# EAGLE design Radio (EAGLE 6.5.0)

## Sheet 1 of 12: Voltage Regulator
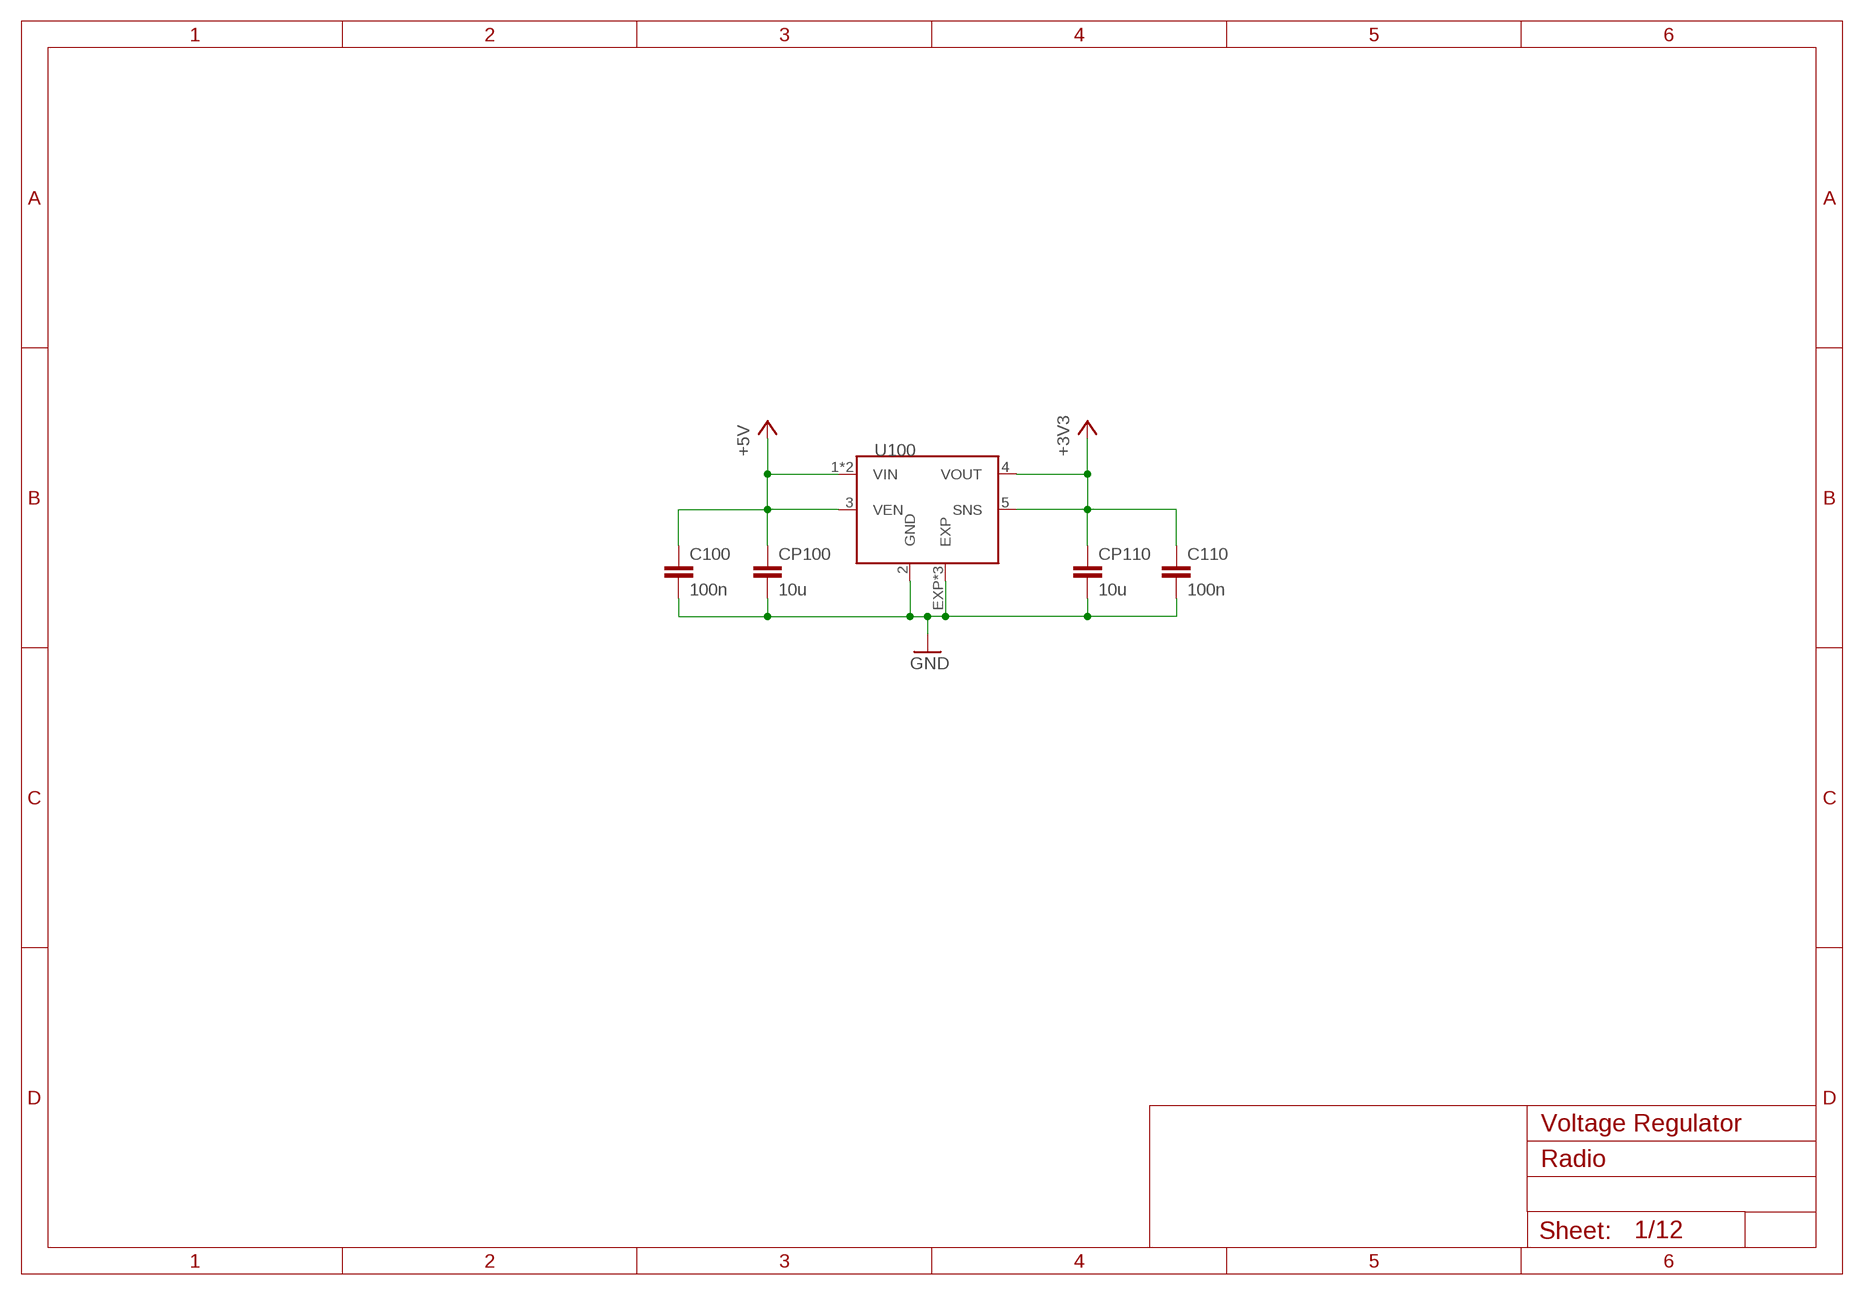
[diagram p0: schematic, sheet 1]

### Parts
C100  100n  C-EUC1206K  [C1206K]
C110  100n  C-EUC1206K  [C1206K]
CP100  10u  C-EUC1206K  [C1206K]
CP110  10u  C-EUC1206K  [C1206K]
U100  LP38693  [LP38693_WSON]

### Nets
+3V3: C110.1 CP110.1 U100.4(VOUT) U100.5(SNS) ; also sheet 2,3,4,5,7,9,11,12
+5V: C100.1 CP100.1 U100.1(VIN) U100.3(VEN) U100.6(VIN) ; also sheet 3,4,6,10,12
GND: C100.2 C110.2 CP100.2 CP110.2 U100.2(GND) U100.EXP U100.EXP1(EXP) U100.EXP2(EXP) ; also sheet 2,4,5,6,7,8,9,10,11,12

## Sheet 2 of 12: MSP430G2553
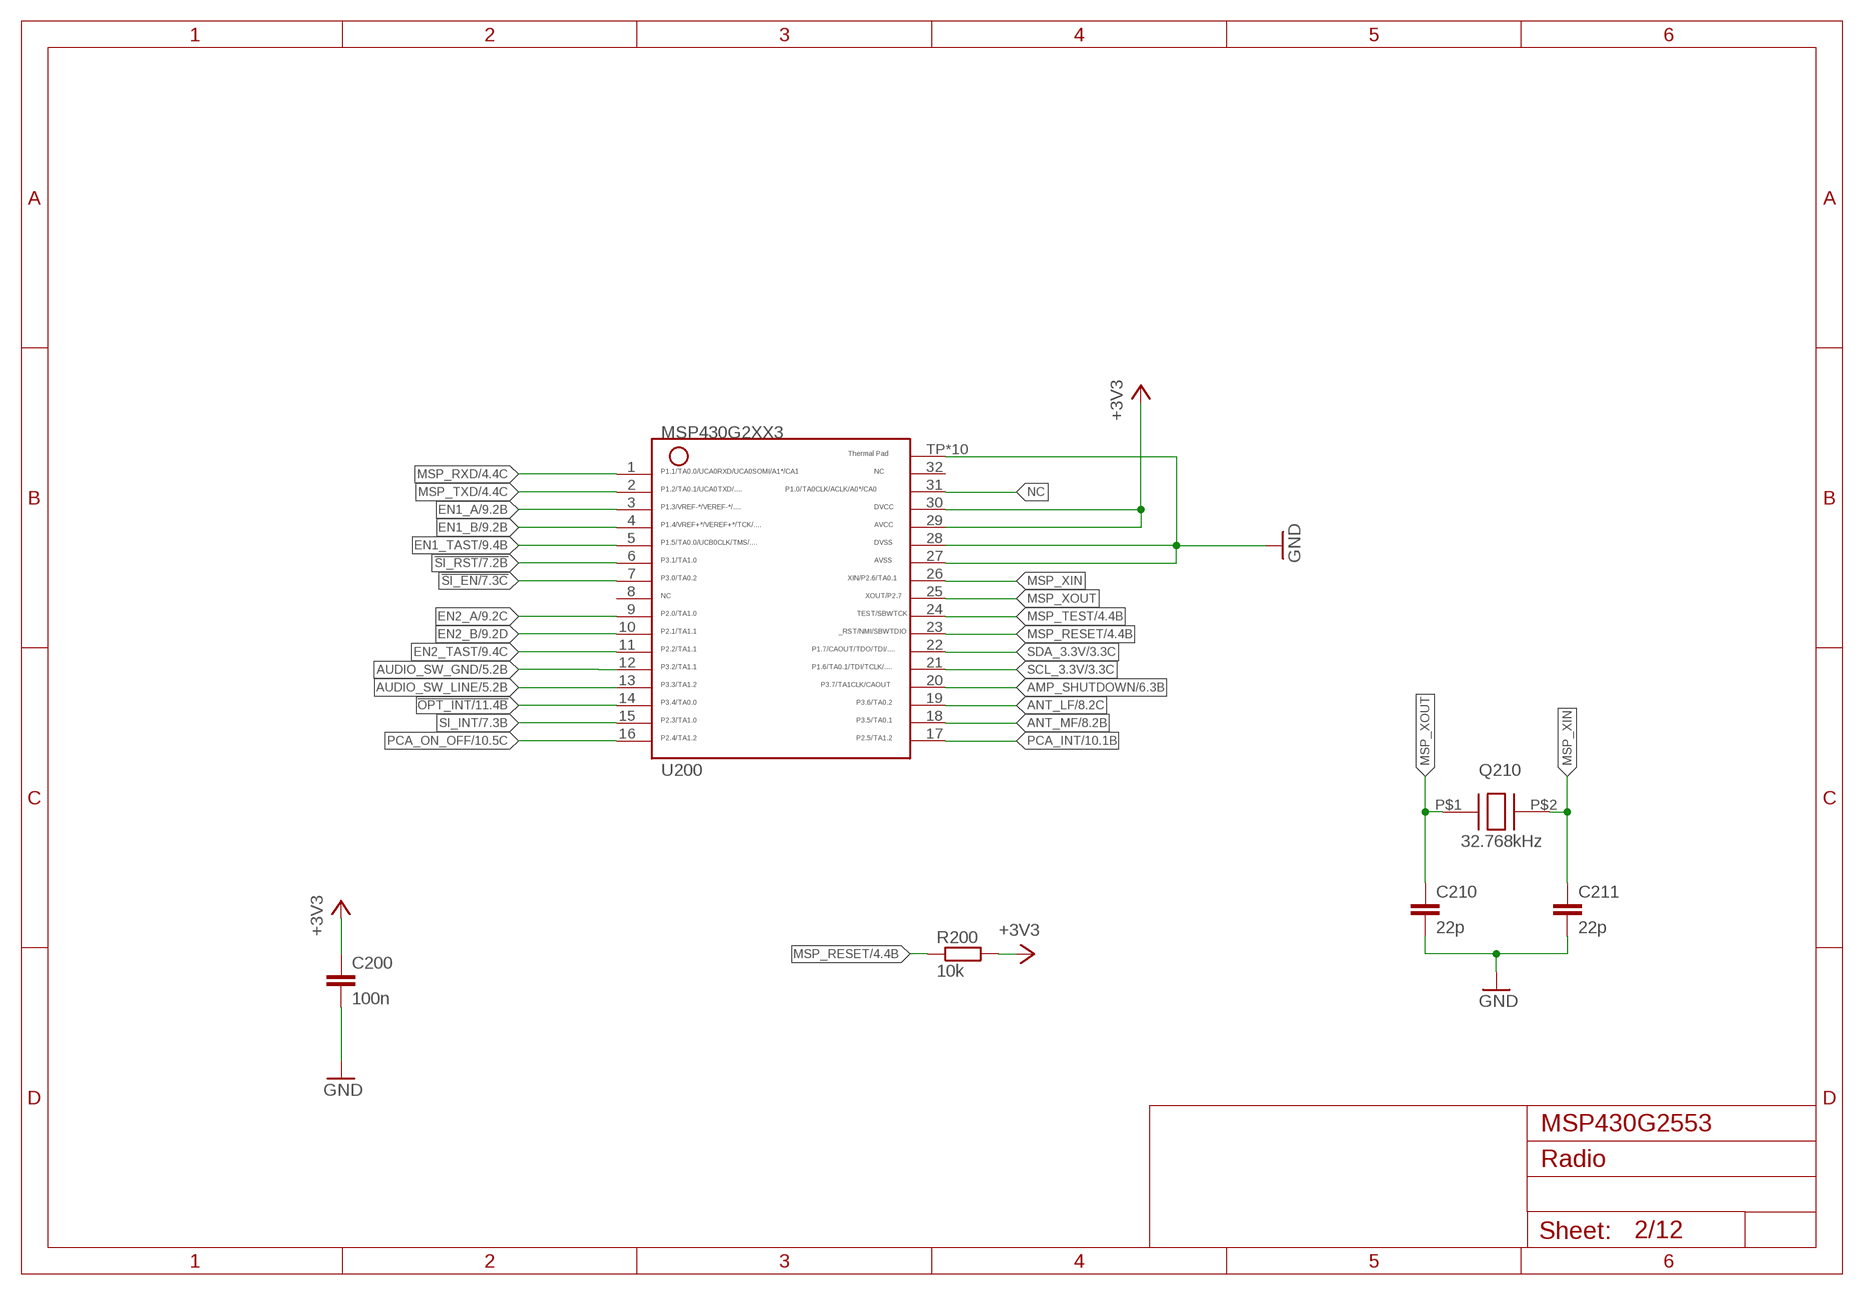
[diagram p1: schematic, sheet 2]

### Parts
C200  100n  C-EUC1206K  [C1206K]
C210  22p  C-EUC1206K  [C1206K]
C211  22p  C-EUC1206K  [C1206K]
Q210  32.768kHz  QUARZ32.768KHZSMD  [CM7V-T1A]
R200  10k  R-EU_R1206  [R1206]
U200  MSP430G2553  G2XX3---RHB32  [RHB32]

### Nets
!OPT_INT: U200.14 ; also sheet 11
!SI_EN: U200.7 ; also sheet 7
!SI_RST: U200.6 ; also sheet 7
+3V3: C200.1 R200.2 U200.29 U200.30 ; also sheet 1,3,4,5,7,9,11,12
AMP_SHUTDOWN: U200.20 ; also sheet 6
ANT_LF: U200.19 ; also sheet 8
ANT_MF: U200.18 ; also sheet 8
AUDIO_SW_GND: U200.12 ; also sheet 5
AUDIO_SW_LINE: U200.13 ; also sheet 5
EN1_A: U200.3 ; also sheet 9
EN1_B: U200.4 ; also sheet 9
EN1_TAST: U200.5 ; also sheet 9
EN2_A: U200.9 ; also sheet 9
EN2_B: U200.10 ; also sheet 9
EN2_TAST: U200.11 ; also sheet 9
GND: C200.2 C210.2 C211.2 U200.27 U200.28 U200.TP U200.TP1(TP) U200.TP2(TP) U200.TP3(TP) U200.TP4(TP) U200.TP5(TP) U200.TP6(TP) U200.TP7(TP) U200.TP8(TP) U200.TP9(TP) ; also sheet 1,4,5,6,7,8,9,10,11,12
MSP_RESET: R200.1 U200.23 ; also sheet 4,12
MSP_RXD: U200.1 ; also sheet 4,12
MSP_TEST: U200.24 ; also sheet 4,12
MSP_TXD: U200.2 ; also sheet 4,12
MSP_XIN: C211.1 Q210.P$2 U200.26
MSP_XOUT: C210.1 Q210.P$1 U200.25
NC: U200.31
PCA_INT: U200.17 ; also sheet 10
PCA_ON_OFF: U200.16 ; also sheet 10
SCL_3.3V: U200.21 ; also sheet 3,4,7,11,12
SDA_3.3V: U200.22 ; also sheet 3,4,7,11,12
SI_INT: U200.15 ; also sheet 7
Unconnected: U200.8 U200.32

## Sheet 3 of 12: I2C Levelshifter
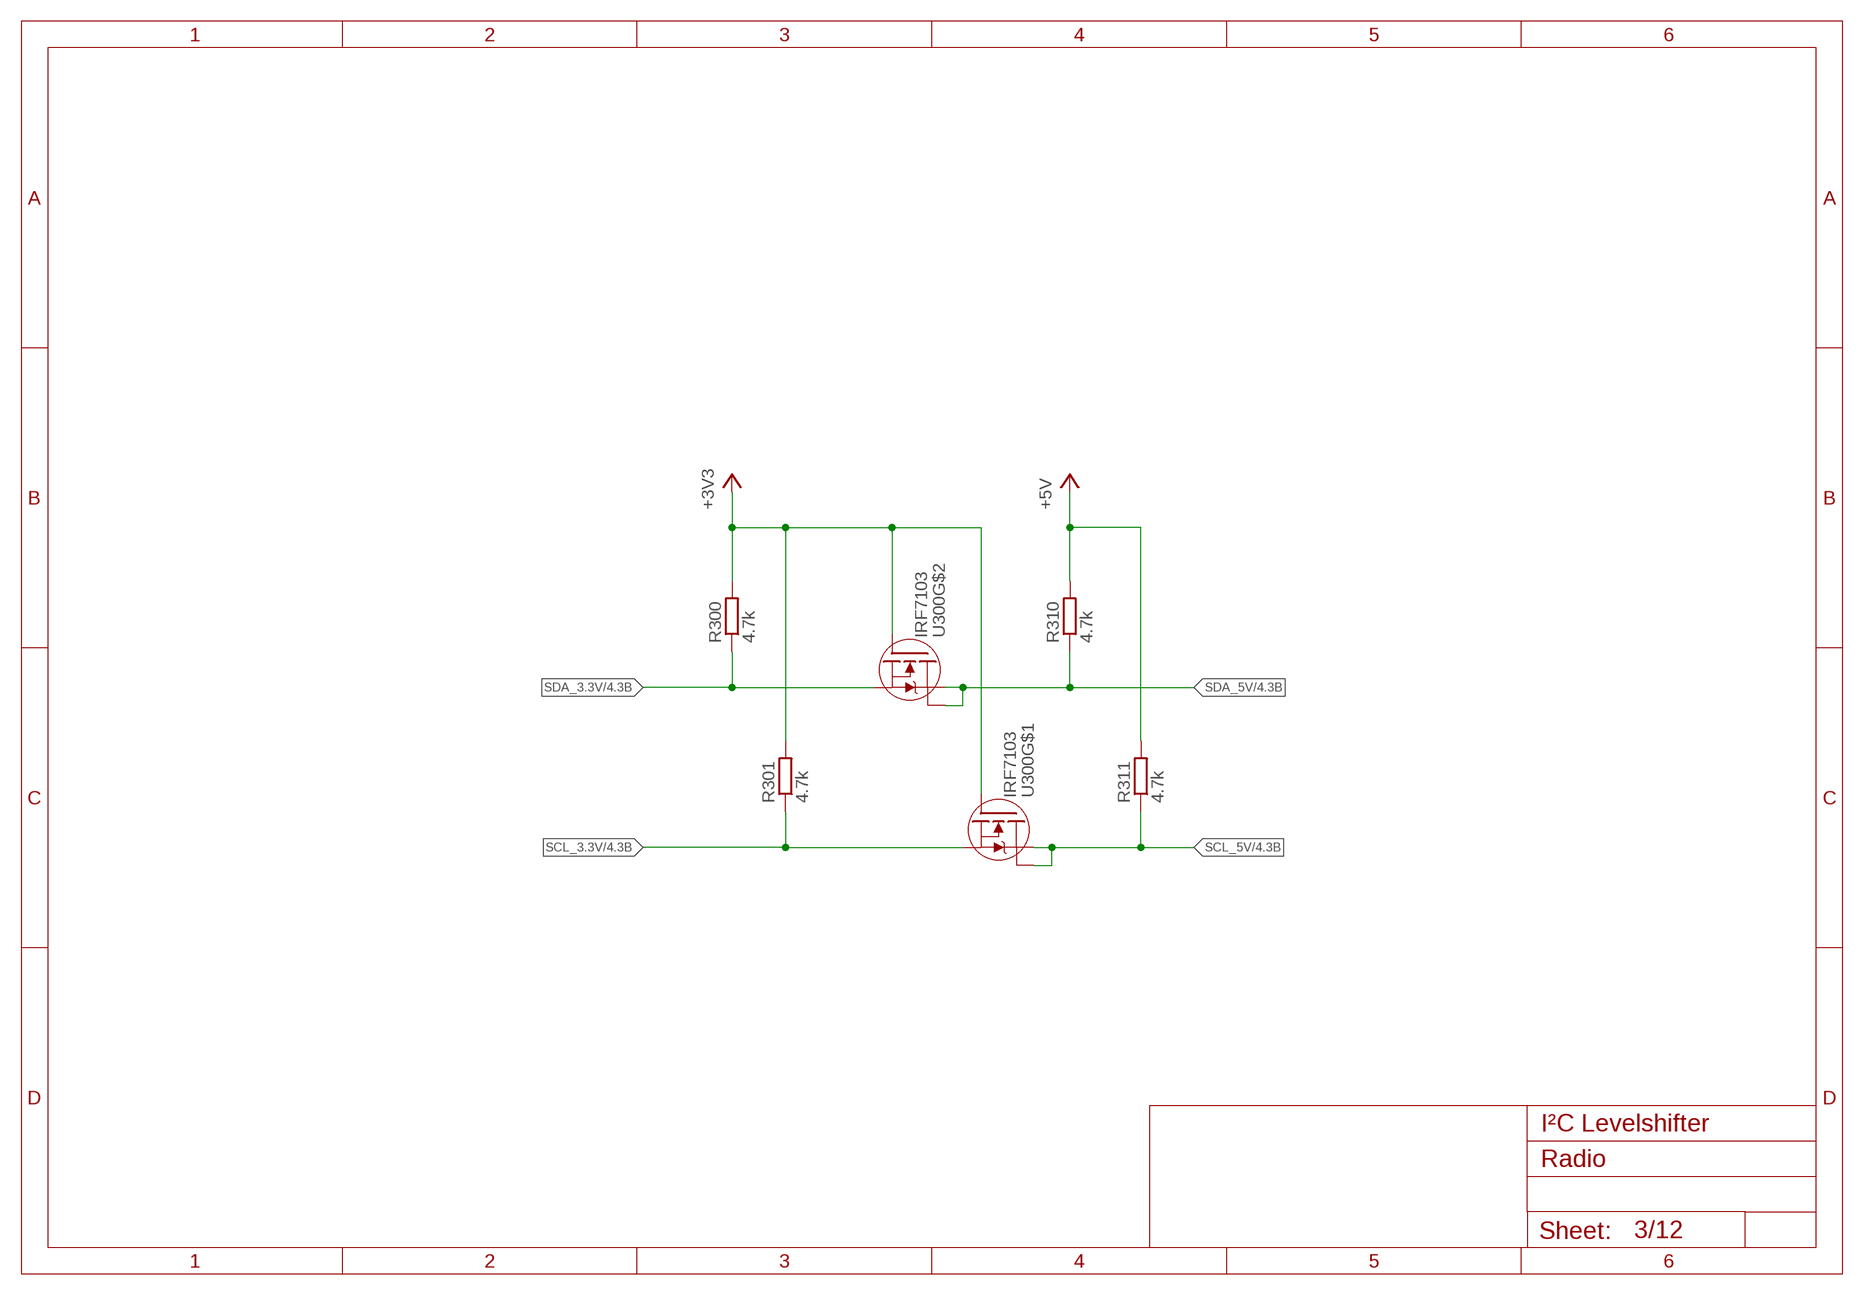
[diagram p2: schematic, sheet 3]

### Parts
R300  4.7k  R-EU_R1206  [R1206]
R301  4.7k  R-EU_R1206  [R1206]
R310  4.7k  R-EU_R1206  [R1206]
R311  4.7k  R-EU_R1206  [R1206]
U300  IRF7103  [SO8-2]

### Nets
+3V3: R300.2 R301.2 U300.2(G) U300.4(G) ; also sheet 1,2,4,5,7,9,11,12
+5V: R310.2 R311.2 ; also sheet 1,4,6,10,12
SCL_3.3V: R301.1 U300.1(S) ; also sheet 2,4,7,11,12
SCL_5V: R311.1 U300.7(D) U300.8(D) ; also sheet 4,6,10,12
SDA_3.3V: R300.1 U300.3(S) ; also sheet 2,4,7,11,12
SDA_5V: R310.1 U300.5(D) U300.6(D) ; also sheet 4,6,10,12

## Sheet 4 of 12: Connector
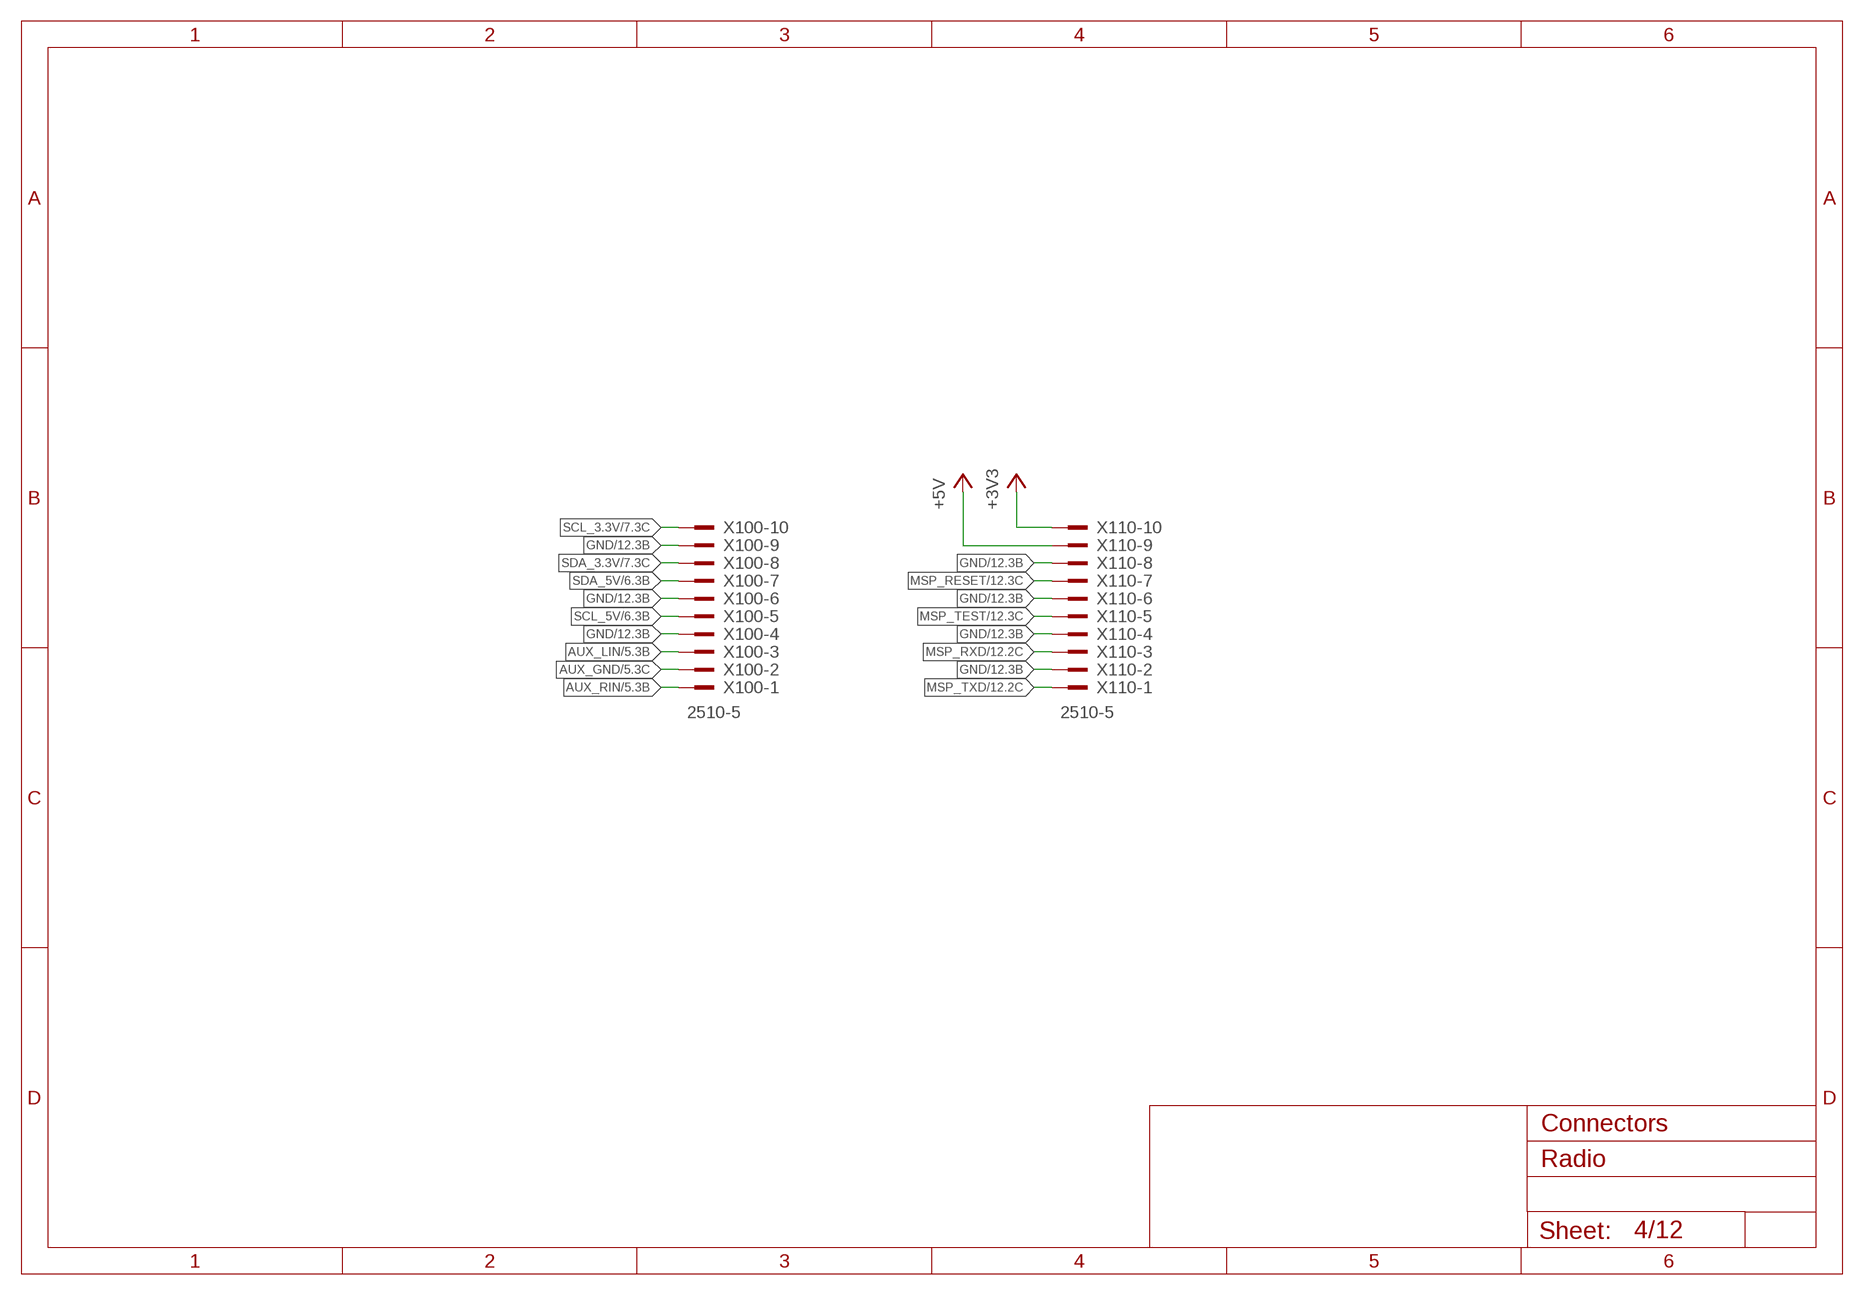
[diagram p3: schematic, sheet 4]

### Parts
X100  2510-5  [PAK100/2500-5-10]
X110  2510-5  [PAK100/2500-5-10]

### Nets
+3V3: X110.10 ; also sheet 1,2,3,5,7,9,11,12
+5V: X110.9 ; also sheet 1,3,6,10,12
AUX_GND: X100.2 ; also sheet 5,12
AUX_LIN: X100.3 ; also sheet 5,12
AUX_RIN: X100.1 ; also sheet 5,12
GND: X100.4 X100.6 X100.9 X110.2 X110.4 X110.6 X110.8 ; also sheet 1,2,5,6,7,8,9,10,11,12
MSP_RESET: X110.7 ; also sheet 2,12
MSP_RXD: X110.3 ; also sheet 2,12
MSP_TEST: X110.5 ; also sheet 2,12
MSP_TXD: X110.1 ; also sheet 2,12
SCL_3.3V: X100.10 ; also sheet 2,3,7,11,12
SCL_5V: X100.5 ; also sheet 3,6,10,12
SDA_3.3V: X100.8 ; also sheet 2,3,7,11,12
SDA_5V: X100.7 ; also sheet 3,6,10,12

## Sheet 5 of 12: Audio Switch
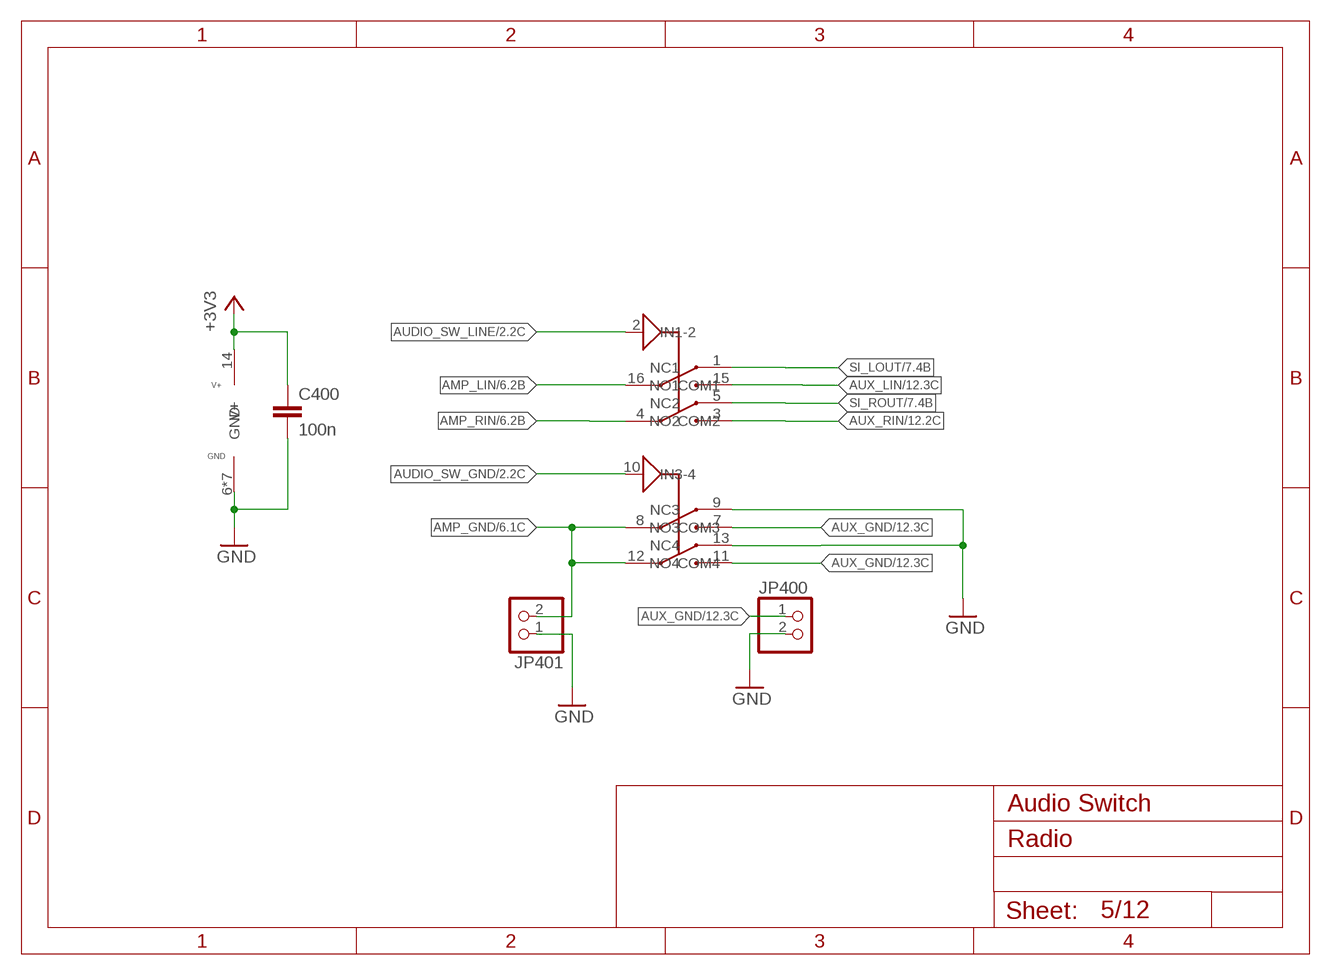
[diagram p4: schematic, sheet 5]

### Parts
C400  100n  C-EUC1206K  [C1206K]
JP400  PINHD-1X2  [1X02]
JP401  PINHD-1X2  [1X02]
U400  TS3A44159RGT  [QFN16]

### Nets
+3V3: C400.1 U400.14(V+) ; also sheet 1,2,3,4,7,9,11,12
AMP_GND: JP401.2 U400.8(COM3) U400.12(COM4) ; also sheet 6
AMP_LIN: U400.16(COM1) ; also sheet 6,12
AMP_RIN: U400.4(COM2) ; also sheet 6,12
AUDIO_SW_GND: U400.10(IN3-4) ; also sheet 2
AUDIO_SW_LINE: U400.2(IN1-2) ; also sheet 2
AUX_GND: JP400.1 U400.7(NO3) U400.11(NO4) ; also sheet 4,12
AUX_LIN: U400.15(NO1) ; also sheet 4,12
AUX_RIN: U400.3(NO2) ; also sheet 4,12
GND: C400.2 JP400.2 JP401.1 U400.6(GND) U400.9(NC3) U400.13(NC4) U400.TH1(GND) U400.TH2(GND) U400.TH3(GND) U400.TH4(GND) U400.TH5(GND) U400.TH(GND) ; also sheet 1,2,4,6,7,8,9,10,11,12
SI_LOUT: U400.1(NC1) ; also sheet 7,12
SI_ROUT: U400.5(NC2) ; also sheet 7,12

## Sheet 6 of 12: TPA2016D2
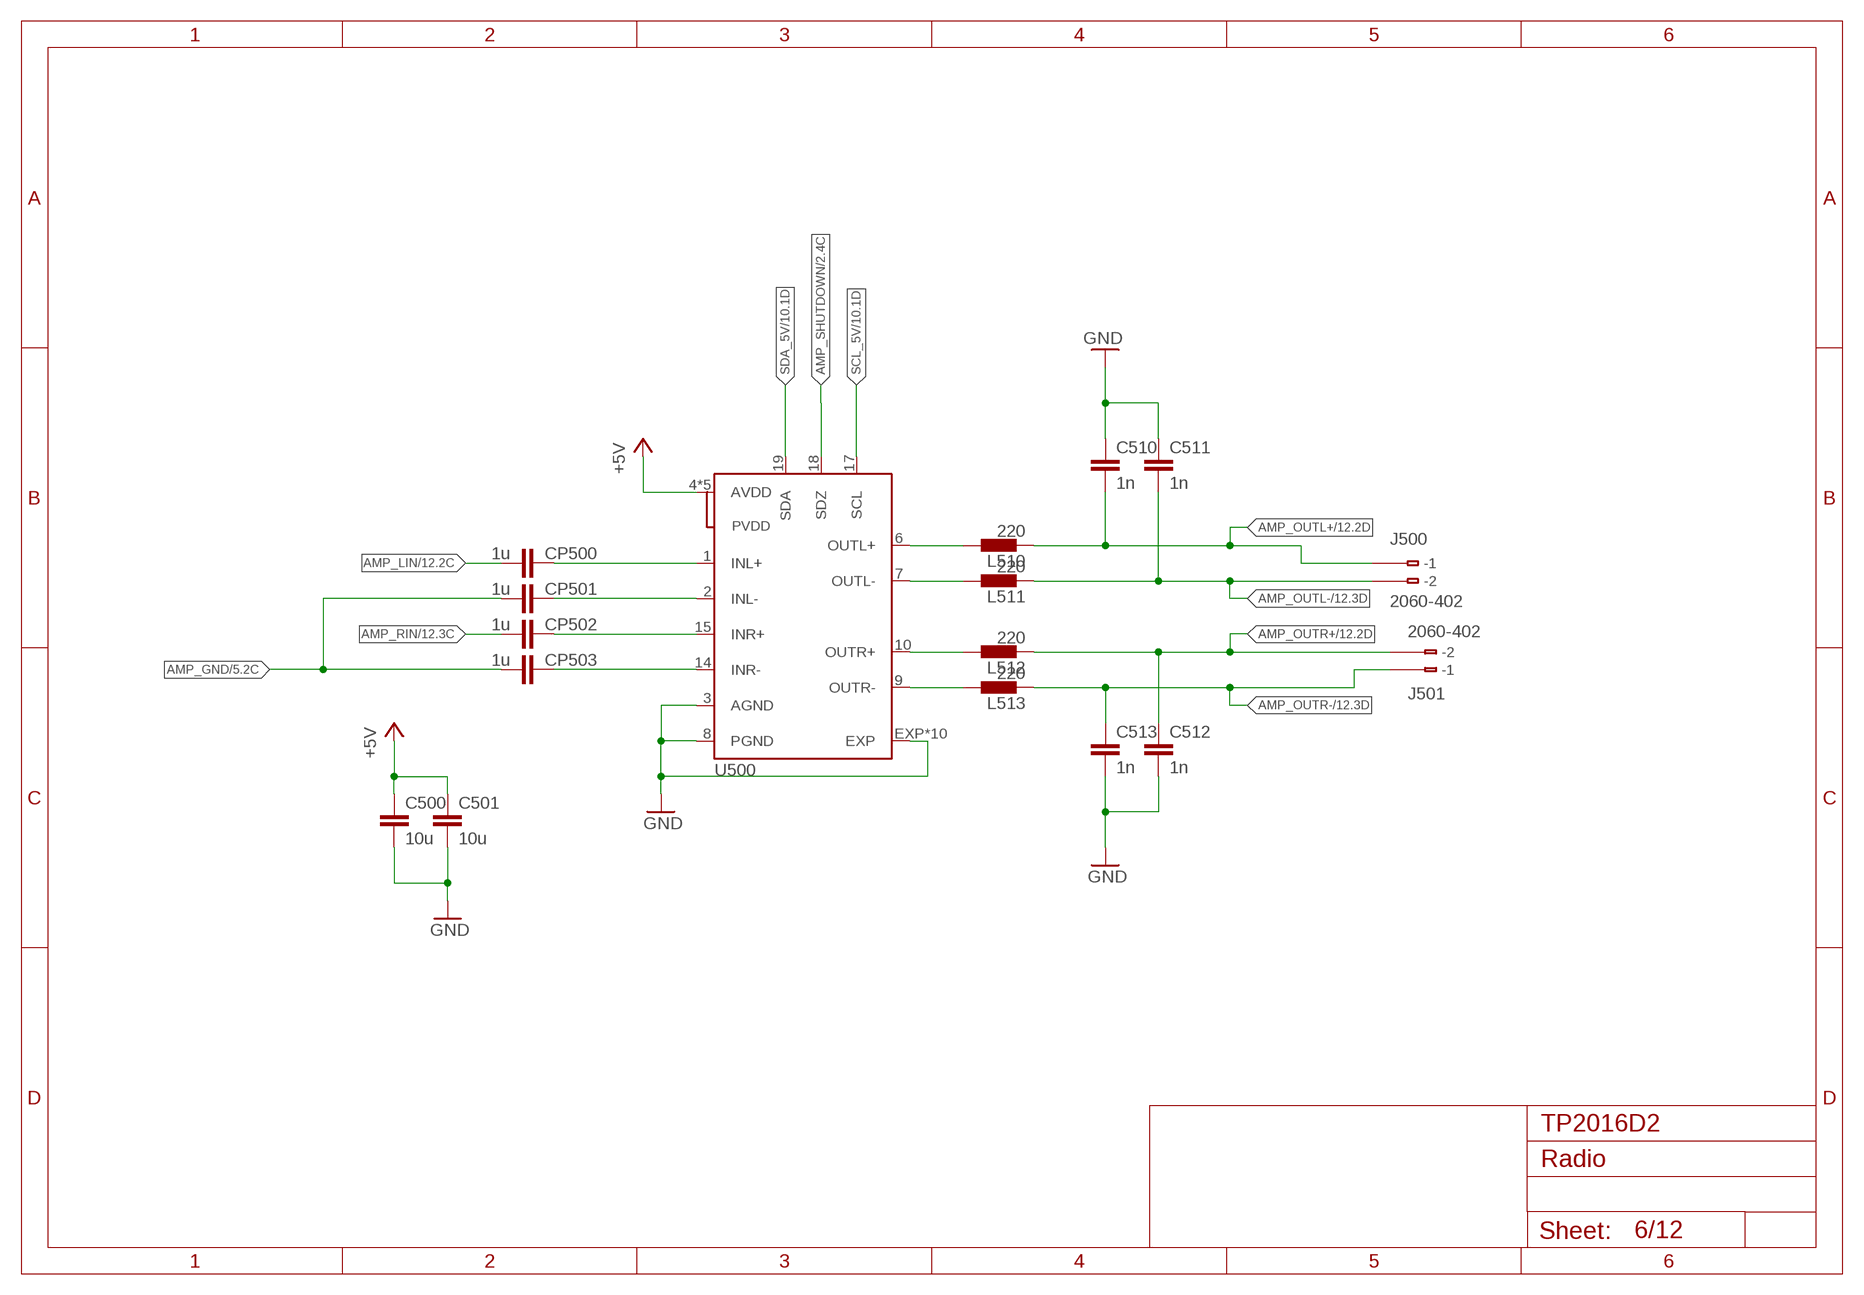
[diagram p5: schematic, sheet 6]

### Parts
C500  10u  C-EUC1206K  [C1206K]
C501  10u  C-EUC1206K  [C1206K]
C510  1n  C-EUC1206K  [C1206K]
C511  1n  C-EUC1206K  [C1206K]
C512  1n  C-EUC1206K  [C1206K]
C513  1n  C-EUC1206K  [C1206K]
CP500  1u  C-EUC1206K  [C1206K]
CP501  1u  C-EUC1206K  [C1206K]
CP502  1u  C-EUC1206K  [C1206K]
CP503  1u  C-EUC1206K  [C1206K]
J500  2060-402  [WAGO_2060-402]
J501  2060-402  [WAGO_2060-402]
L510  220  BLM15H  [R0603]
L511  220  BLM15H  [R0603]
L512  220  BLM15H  [R0603]
L513  220  BLM15H  [R0603]
U500  TPA2016D2  [TPA2016D2_PWQFN-20]

### Nets
+5V: C500.1 C501.1 U500.4(AVDD) U500.5(AVDD) U500.11(AVDD) U500.12(AVDD) U500.13(AVDD) ; also sheet 1,3,4,10,12
AMP_GND: CP501.2 CP503.2 ; also sheet 5
AMP_LIN: CP500.2 ; also sheet 5,12
AMP_OUTL+: C510.2 J500.B-1 L510.1 ; also sheet 12
AMP_OUTL-: C511.2 J500.B-2 L511.1 ; also sheet 12
AMP_OUTR+: C512.1 J501.B-2 L512.1 ; also sheet 12
AMP_OUTR-: C513.1 J501.B-1 L513.1 ; also sheet 12
AMP_RIN: CP502.2 ; also sheet 5,12
AMP_SHUTDOWN: U500.18(SDZ) ; also sheet 2
GND: C500.2 C501.2 C510.1 C511.1 C512.2 C513.2 U500.3(AGND) U500.8(PGND) U500.EXP U500.EXP1(EXP) U500.EXP2(EXP) U500.EXP3(EXP) U500.EXP4(EXP) U500.EXP5(EXP) U500.EXP6(EXP) U500.EXP7(EXP) U500.EXP8(EXP) U500.EXP9(EXP) ; also sheet 1,2,4,5,7,8,9,10,11,12
N$9: L510.2 U500.6(OUTL+)
N$10: L511.2 U500.7(OUTL-)
N$11: L512.2 U500.10(OUTR+)
N$12: L513.2 U500.9(OUTR-)
N$17: CP500.1 U500.1(INL+)
N$18: CP502.1 U500.15(INR+)
N$19: CP501.1 U500.2(INL-)
N$20: CP503.1 U500.14(INR-)
SCL_5V: U500.17(SCL) ; also sheet 3,4,10,12
SDA_5V: U500.19(SDA) ; also sheet 3,4,10,12
Unconnected: J500.1(-1) J500.2(-2) J501.1(-1) J501.2(-2)

## Sheet 7 of 12: SI4735
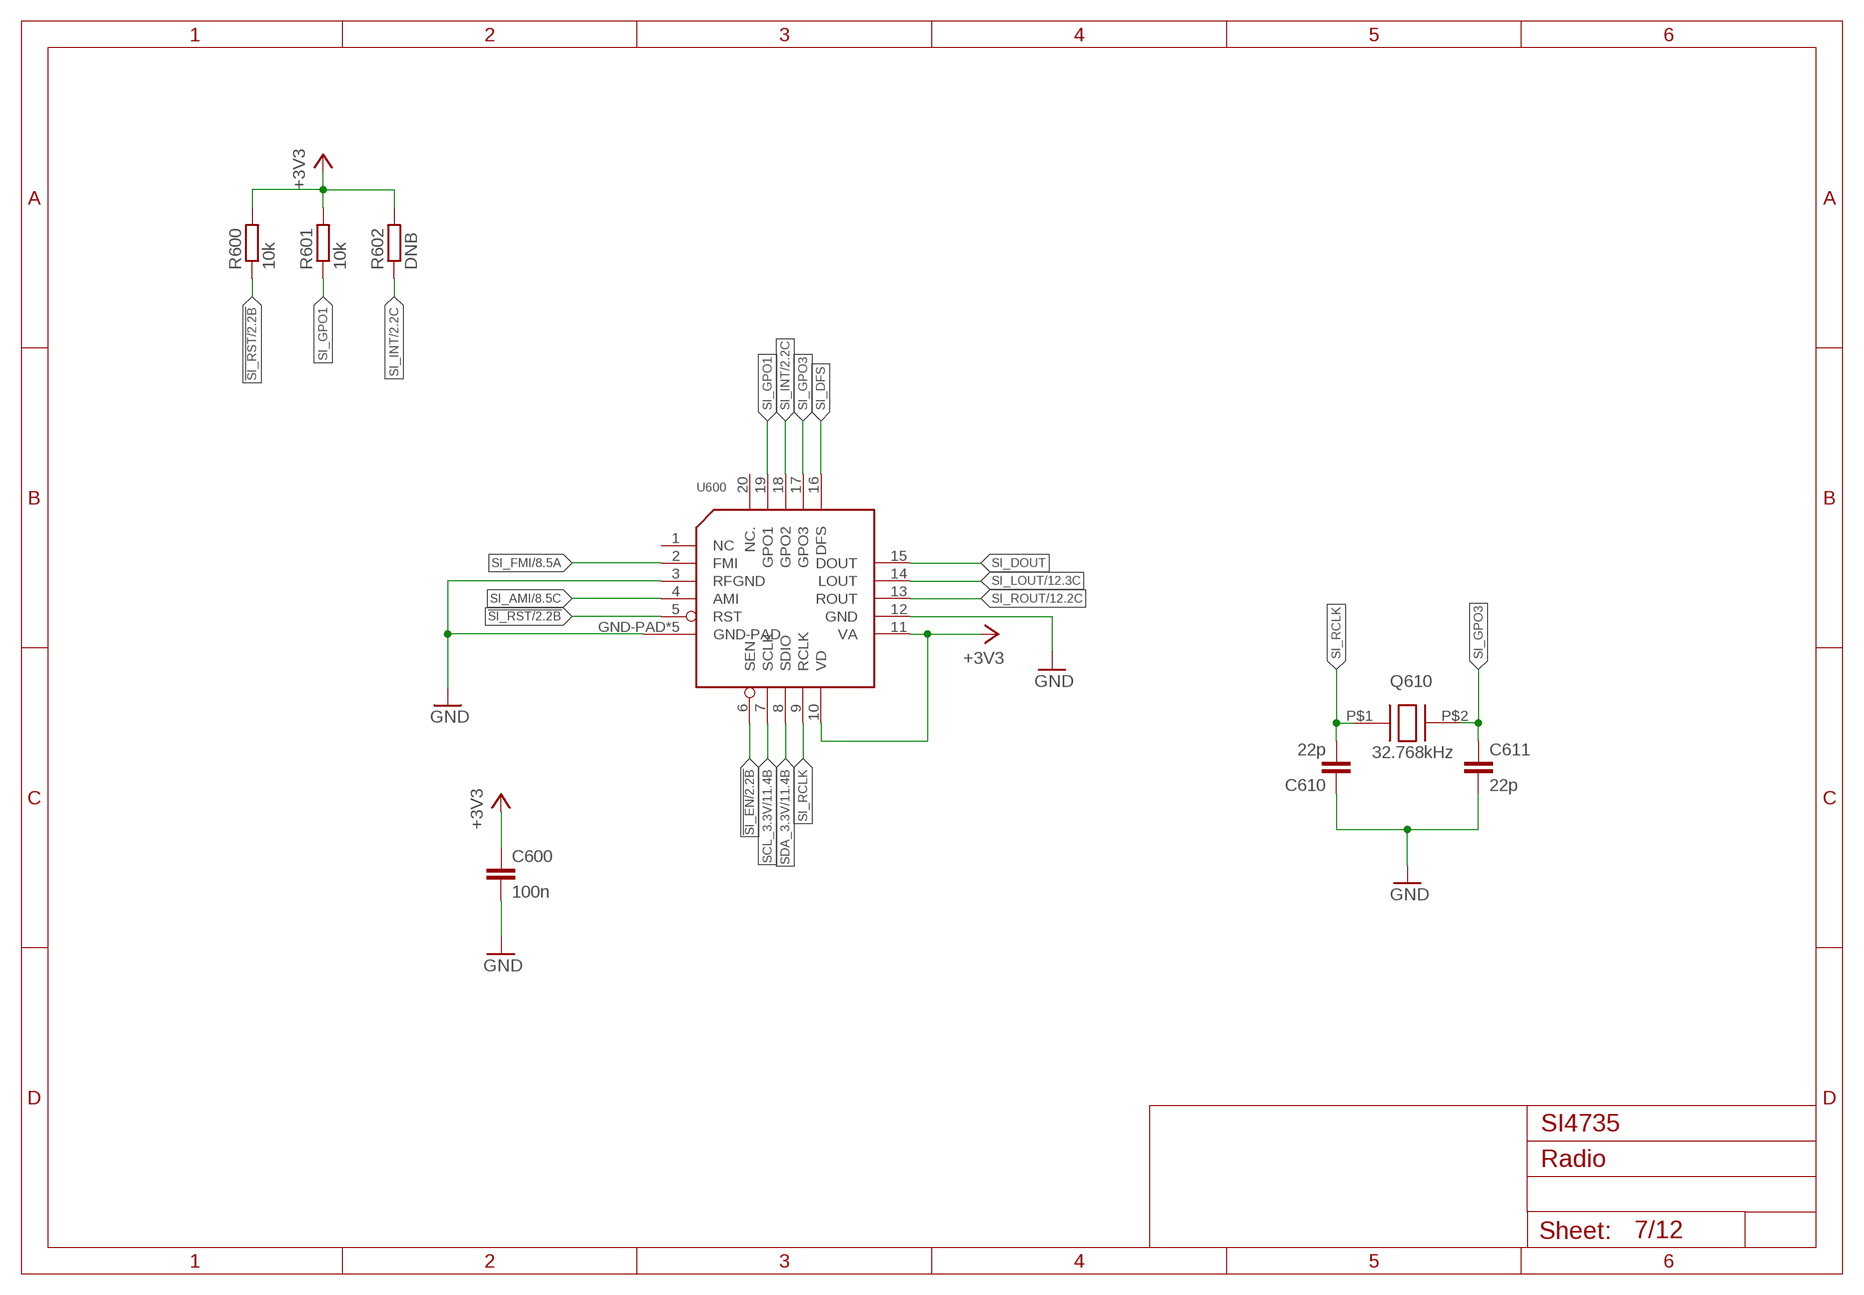
[diagram p6: schematic, sheet 7]

### Parts
C600  100n  C-EUC1206K  [C1206K]
C610  22p  C-EUC1206K  [C1206K]
C611  22p  C-EUC1206K  [C1206K]
Q610  32.768kHz  QUARZ32.768KHZSMD  [CM7V-T1A]
R600  10k  R-EU_R1206  [R1206]
R601  10k  R-EU_R1206  [R1206]
R602  DNB  R-EU_R1206  [R1206]
U600  SI473X-D60  [SI473X-D60]

### Nets
!SI_EN: U600.6(SEN) ; also sheet 2
!SI_RST: R600.1 U600.5(RST) ; also sheet 2
+3V3: C600.1 R600.2 R601.2 R602.2 U600.10(VD) U600.11(VA) ; also sheet 1,2,3,4,5,9,11,12
GND: C600.2 C610.1 C611.2 U600.3(RFGND) U600.12(GND) U600.GND-PAD U600.GND-PAD1(GND-PAD) U600.GND-PAD2(GND-PAD) U600.GND-PAD3(GND-PAD) U600.GND-PAD4(GND-PAD) ; also sheet 1,2,4,5,6,8,9,10,11,12
SCL_3.3V: U600.7(SCLK) ; also sheet 2,3,4,11,12
SDA_3.3V: U600.8(SDIO) ; also sheet 2,3,4,11,12
SI_AMI: U600.4(AMI) ; also sheet 8
SI_DFS: U600.16(DFS)
SI_DOUT: U600.15(DOUT)
SI_FMI: U600.2(FMI) ; also sheet 8
SI_GPO1: R601.1 U600.19(GPO1)
SI_GPO3: C611.1 Q610.P$2 U600.17(GPO3)
SI_INT: R602.1 U600.18(GPO2) ; also sheet 2
SI_LOUT: U600.14(LOUT) ; also sheet 5,12
SI_RCLK: C610.2 Q610.P$1 U600.9(RCLK)
SI_ROUT: U600.13(ROUT) ; also sheet 5,12
Unconnected: U600.1(NC) U600.20(NC.)

## Sheet 8 of 12: SI4735 Antenne
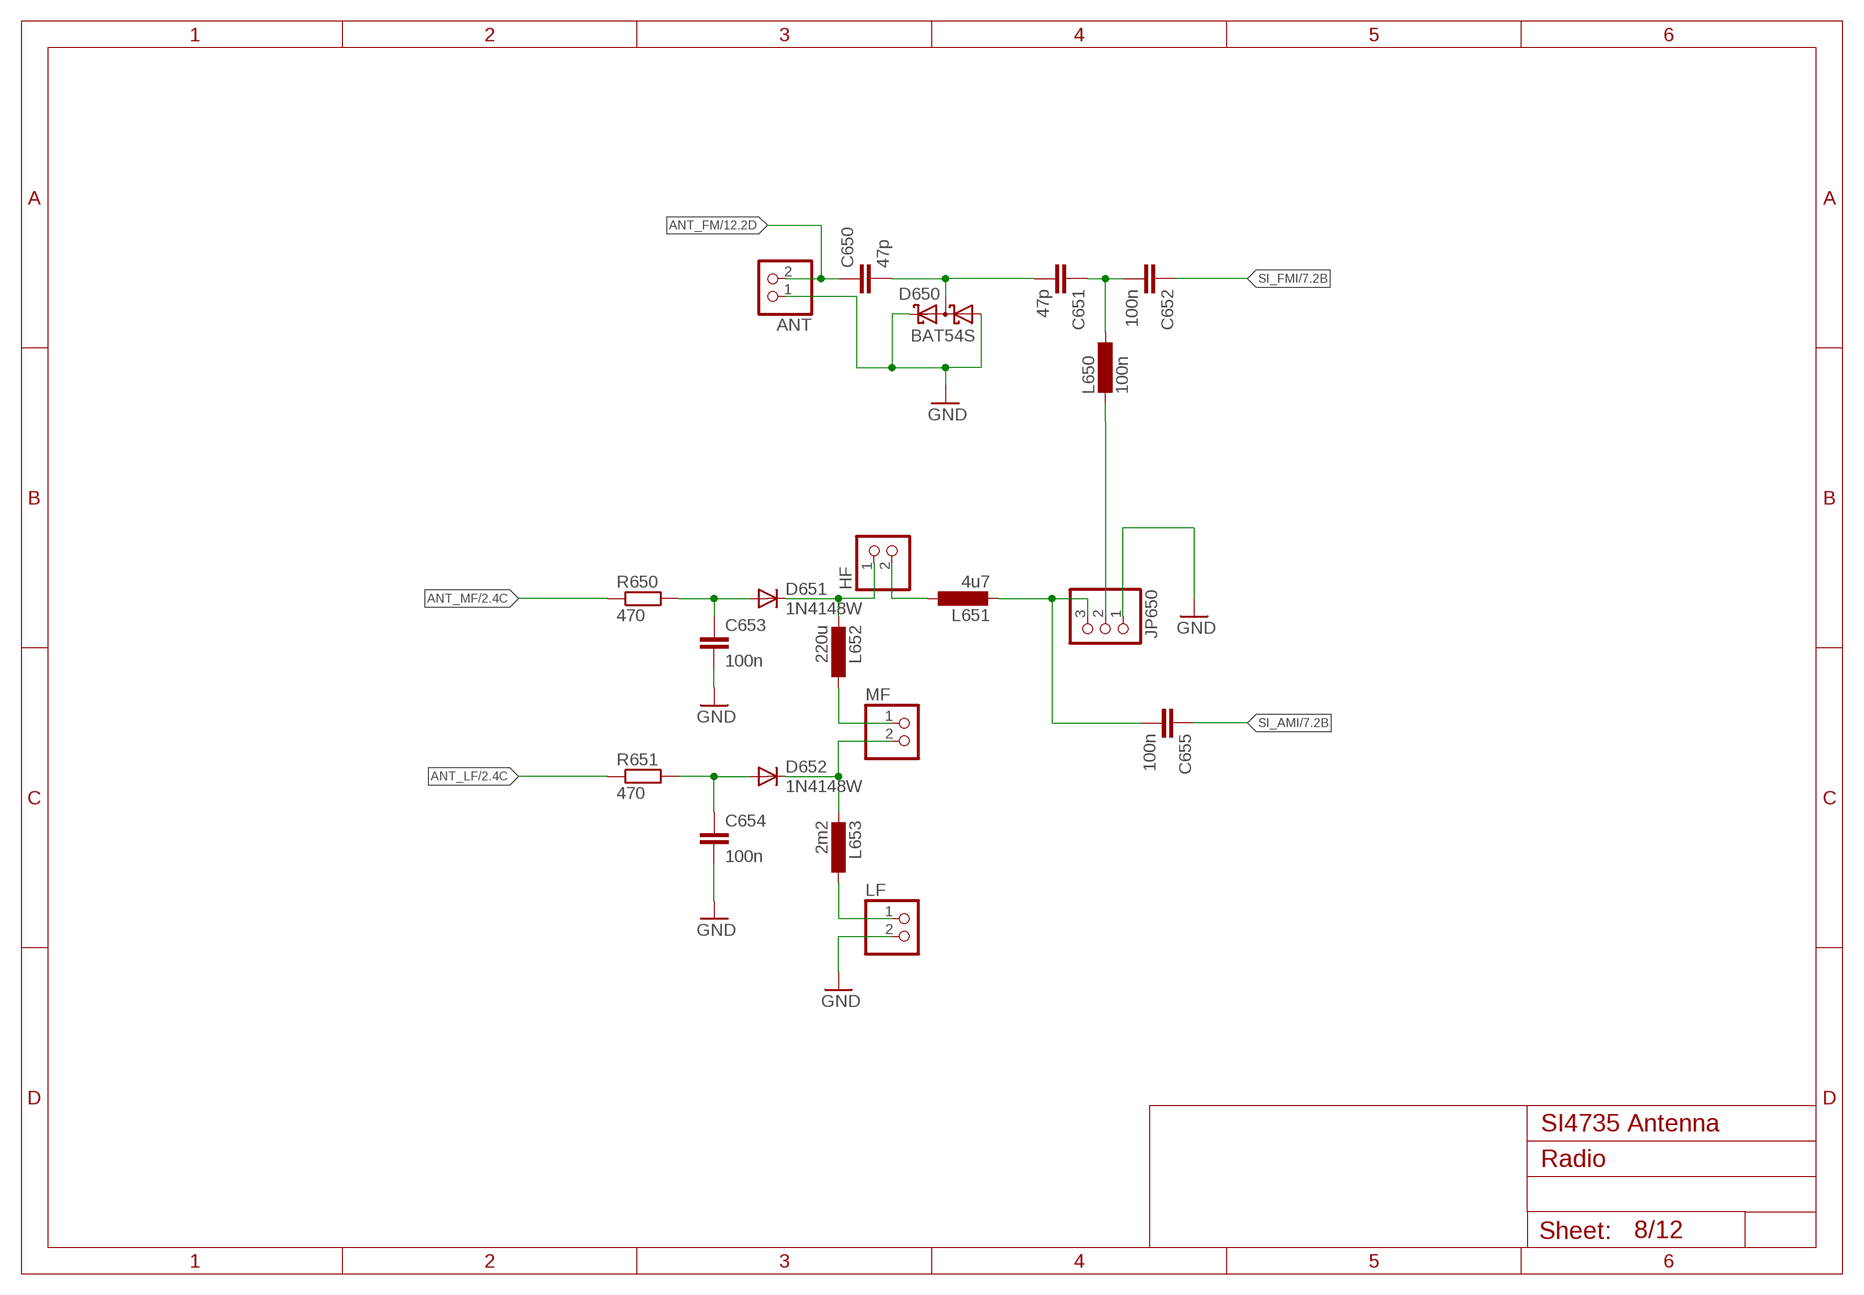
[diagram p7: schematic, sheet 8]

### Parts
ANT  PINHD-1X2  [1X02]
C650  47p  C-EUC1206K  [C1206K]
C651  47p  C-EUC1206K  [C1206K]
C652  100n  C-EUC1206K  [C1206K]
C653  100n  C-EUC1206K  [C1206K]
C654  100n  C-EUC1206K  [C1206K]
C655  100n  C-EUC1206K  [C1206K]
D650  BAT54S  [SOT23]
D651  1N4148W  DIODE-SOD123  [SOD123]
D652  1N4148W  DIODE-SOD123  [SOD123]
HF  PINHD-1X2  [1X02]
JP650  PINHD-1X3  [1X03]
L650  100n  L-EU  [L1210]
L651  4u7  L-EU  [L1210]
L652  220u  L-EU  [L1210]
L653  2m2  L-EUL1812  [L1812]
LF  PINHD-1X2  [1X02]
MF  PINHD-1X2  [1X02]
R650  470  R-EU_R1206  [R1206]
R651  470  R-EU_R1206  [R1206]

### Nets
ANT_FM: ANT.2 C650.1 ; also sheet 12
ANT_LF: R651.1 ; also sheet 2
ANT_MF: R650.1 ; also sheet 2
GND: ANT.1 C653.2 C654.2 D650.1(A1) D650.2(C2) JP650.1 LF.2 ; also sheet 1,2,4,5,6,7,9,10,11,12
N$2: C650.2 C651.2 D650.3(C1A2)
N$28: HF.2 L651.1
N$29: JP650.2 L650.2
N$30: C655.2 JP650.3 L651.2
N$31: D651.C HF.1 L652.2
N$34: D652.C L653.2 MF.2
N$38: C654.1 D652.A R651.2
N$39: C653.1 D651.A R650.2
N$40: L653.1 LF.1
N$42: L652.1 MF.1
N$43: C651.1 C652.2 L650.1
SI_AMI: C655.1 ; also sheet 7
SI_FMI: C652.1 ; also sheet 7

## Sheet 9 of 12: Encoder
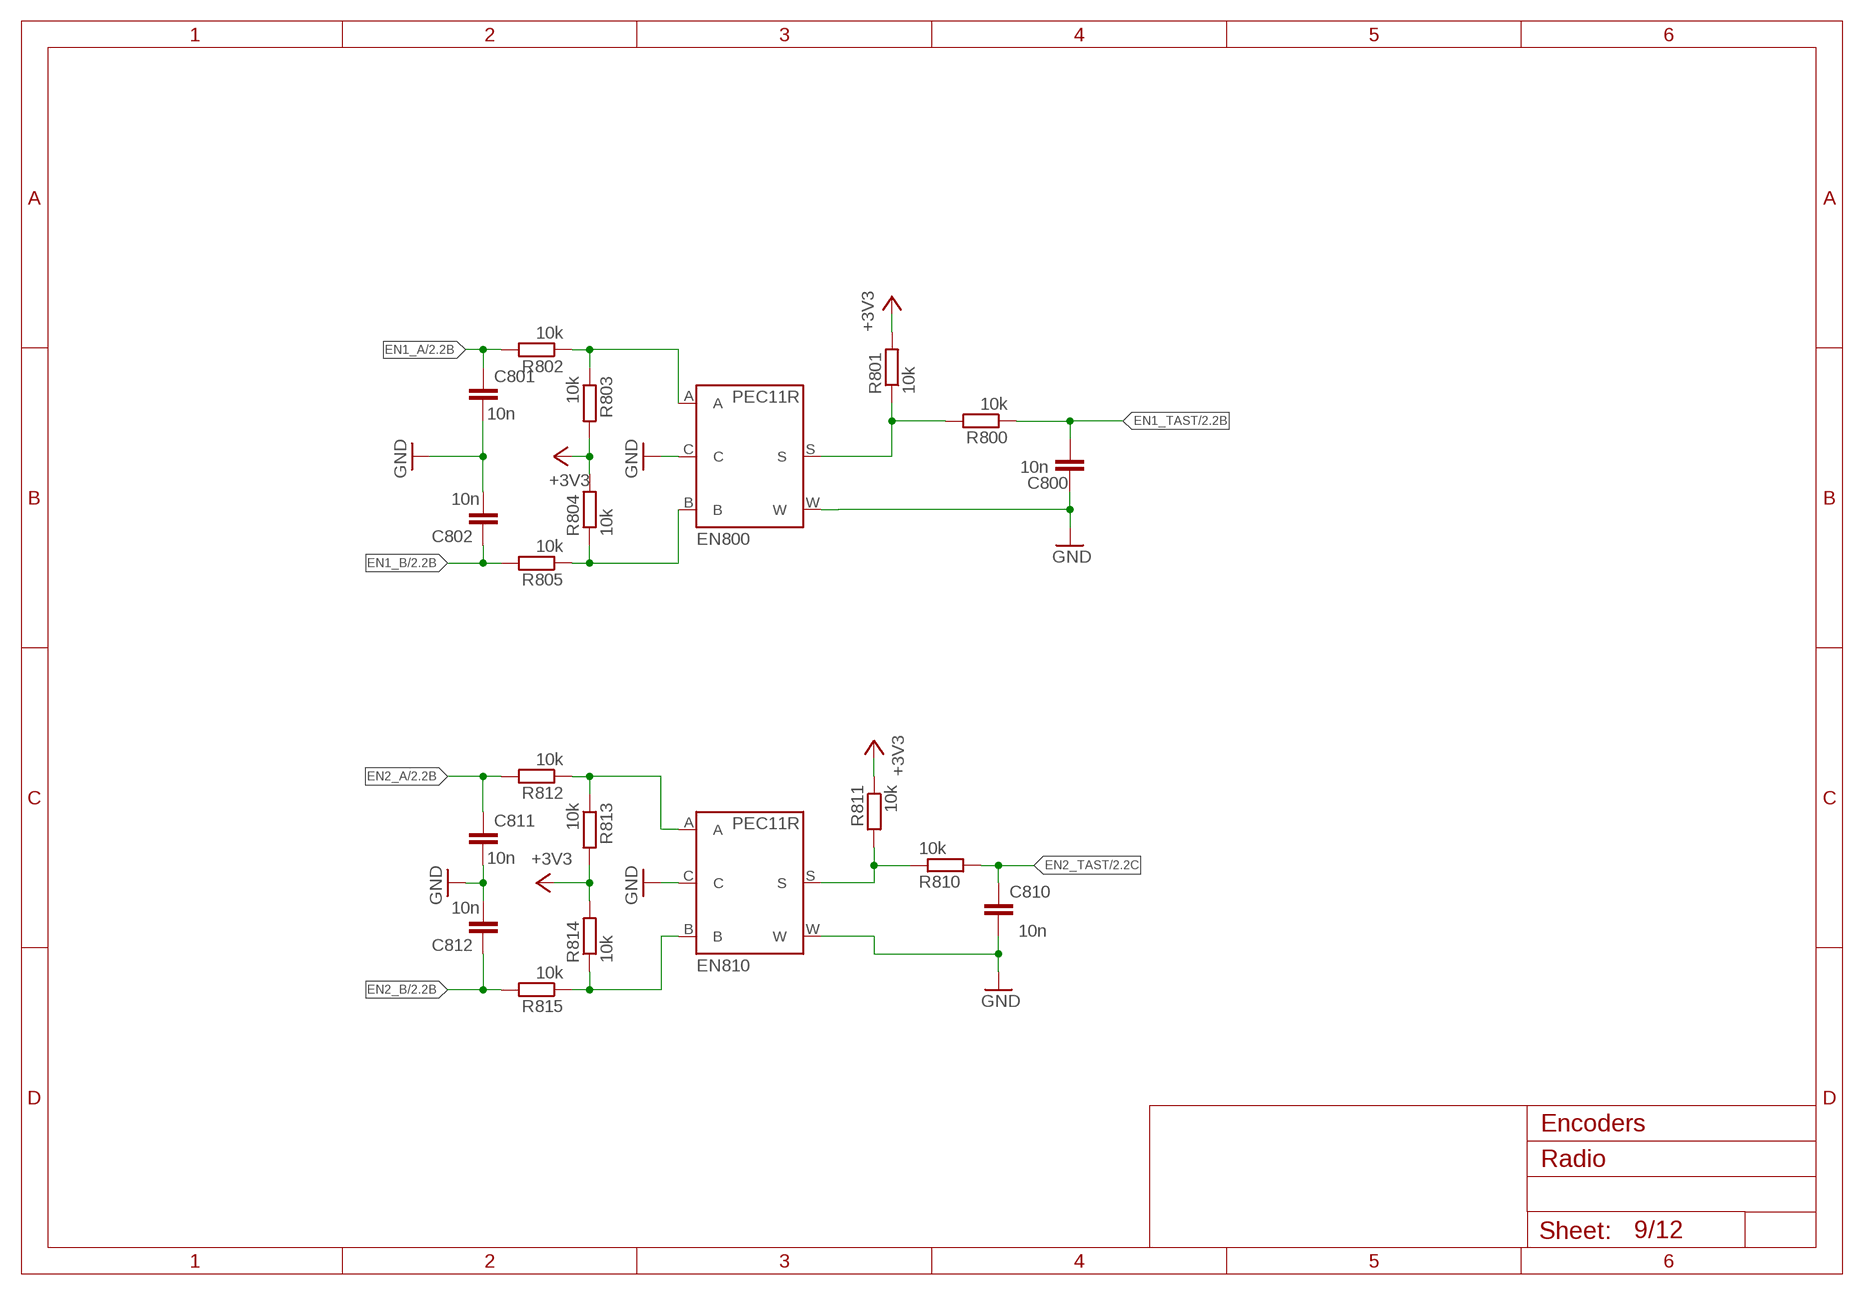
[diagram p8: schematic, sheet 9]

### Parts
C800  10n  C-EUC1206K  [C1206K]
C801  10n  C-EUC1206K  [C1206K]
C802  10n  C-EUC1206K  [C1206K]
C810  10n  C-EUC1206K  [C1206K]
C811  10n  C-EUC1206K  [C1206K]
C812  10n  C-EUC1206K  [C1206K]
EN800  PEC11R  [PEC11R]
EN810  PEC11R  [PEC11R]
R800  10k  R-EU_R1206  [R1206]
R801  10k  R-EU_R1206  [R1206]
R802  10k  R-EU_R1206  [R1206]
R803  10k  R-EU_R1206  [R1206]
R804  10k  R-EU_R1206  [R1206]
R805  10k  R-EU_R1206  [R1206]
R810  10k  R-EU_R1206  [R1206]
R811  10k  R-EU_R1206  [R1206]
R812  10k  R-EU_R1206  [R1206]
R813  10k  R-EU_R1206  [R1206]
R814  10k  R-EU_R1206  [R1206]
R815  10k  R-EU_R1206  [R1206]

### Nets
+3V3: R801.2 R803.2 R804.2 R811.1 R813.2 R814.2 ; also sheet 1,2,3,4,5,7,11,12
EN1_A: C801.1 R802.2 ; also sheet 2
EN1_B: C802.1 R805.2 ; also sheet 2
EN1_TAST: C800.2 R800.1 ; also sheet 2
EN2_A: C811.1 R812.2 ; also sheet 2
EN2_B: C812.1 R815.2 ; also sheet 2
EN2_TAST: C810.1 R810.2 ; also sheet 2
GND: C800.1 C801.2 C802.2 C810.2 C811.2 C812.2 EN800.C EN800.W EN810.C EN810.W ; also sheet 1,2,4,5,6,7,8,10,11,12
N$32: EN810.A R812.1 R813.1
N$33: EN800.A R802.1 R803.1
N$35: EN810.B R814.1 R815.1
N$36: EN800.S R800.2 R801.1
N$37: EN810.S R810.1 R811.2
R904: EN800.B R804.1 R805.1

## Sheet 10 of 12: Display
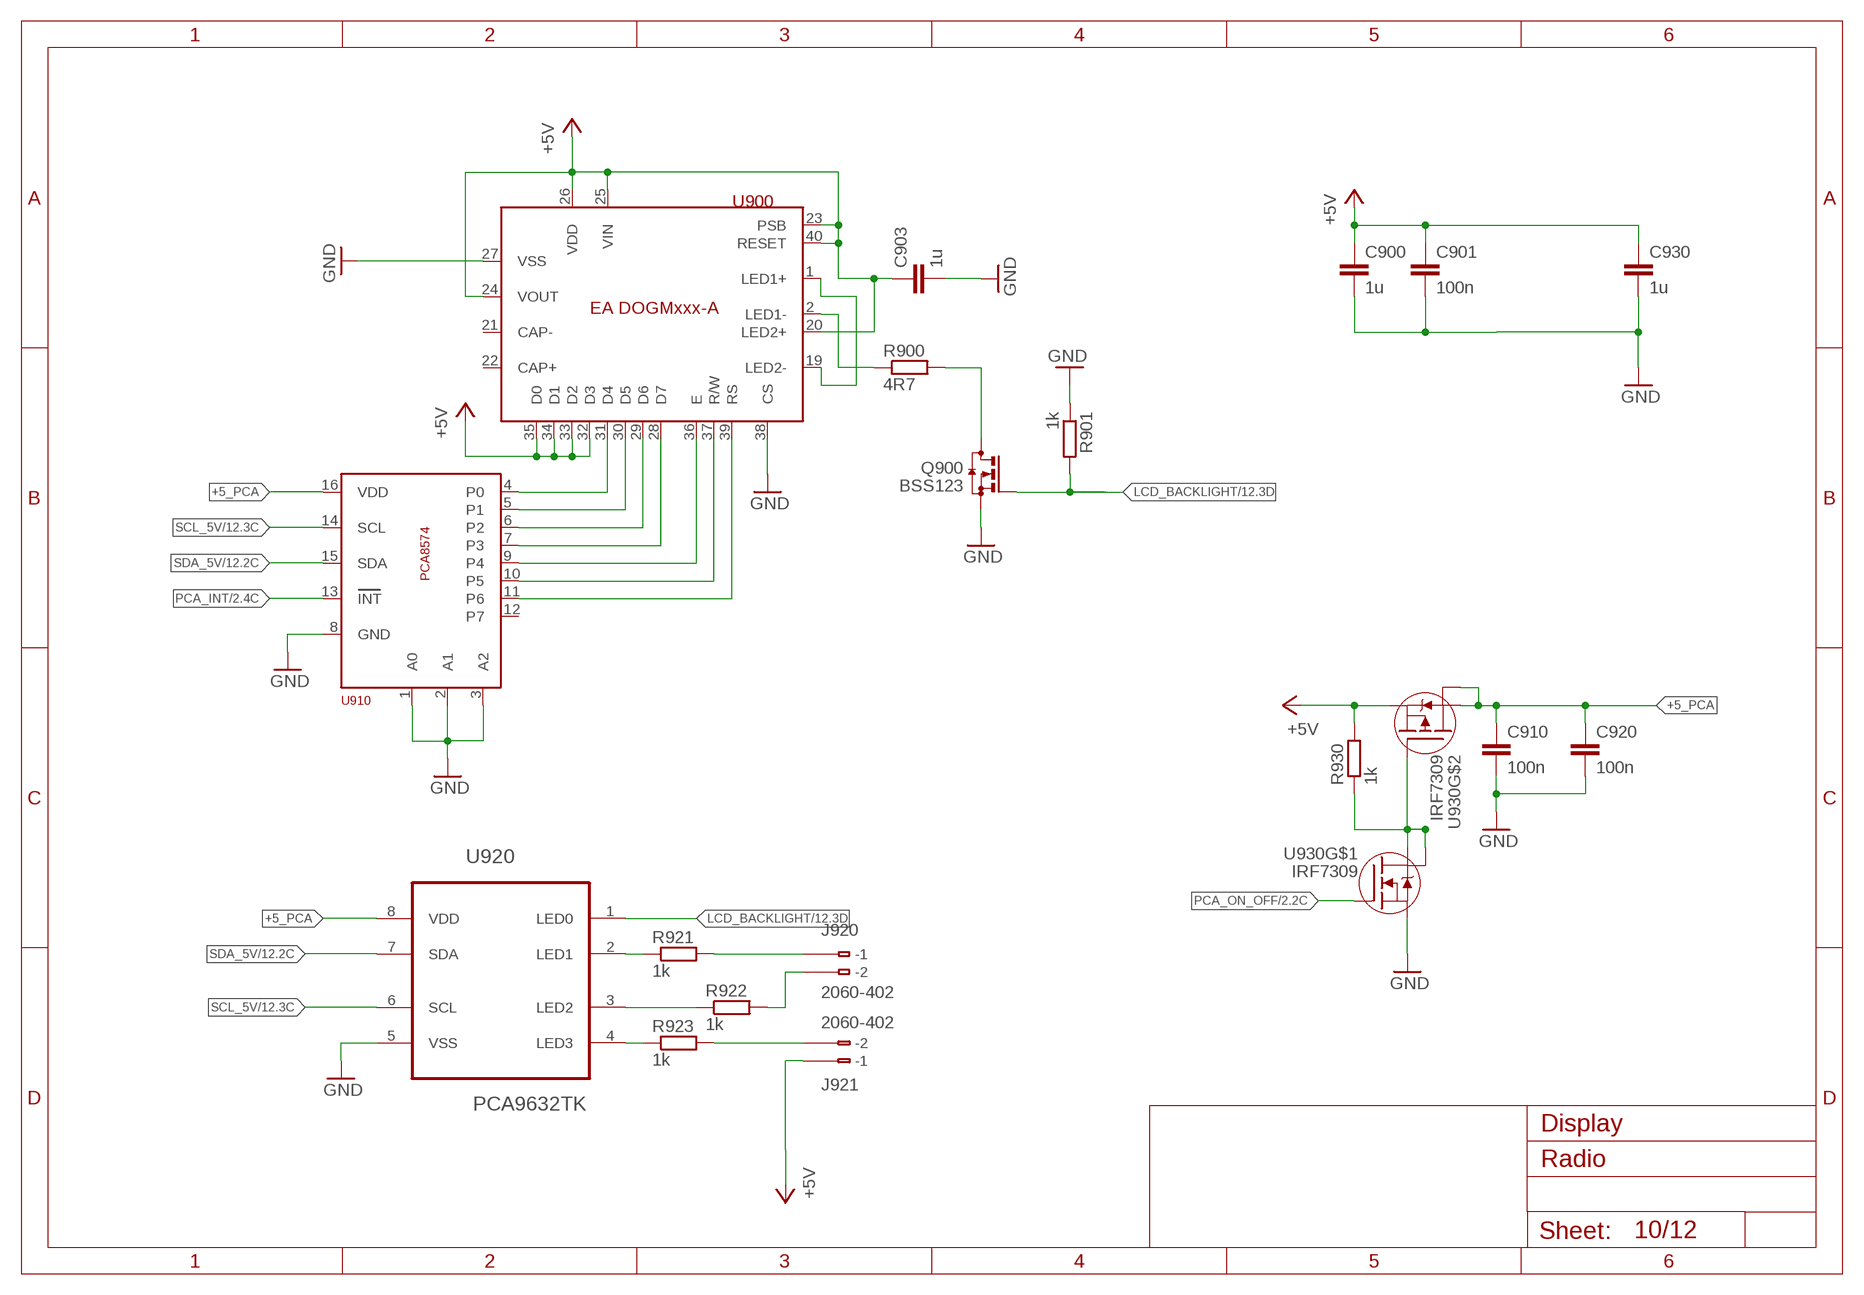
[diagram p9: schematic, sheet 10]

### Parts
C900  1u  C-EUC1206K  [C1206K]
C901  100n  C-EUC1206K  [C1206K]
C903  1u  C-EUC1206K  [C1206K]
C910  100n  C-EUC1206K  [C1206K]
C920  100n  C-EUC1206K  [C1206K]
C930  1u  C-EUC1206K  [C1206K]
J920  2060-402  [WAGO_2060-402]
J921  2060-402  [WAGO_2060-402]
Q900  BSS123  [SOT23]
R900  4R7  R-EU_R1206  [R1206]
R901  1k  R-EU_R1206  [R1206]
R921  1k  R-EU_R1206  [R1206]
R922  1k  R-EU_R1206  [R1206]
R923  1k  R-EU_R1206  [R1206]
R930  1k  R-EU_R1206  [R1206]
U900  EA_DOGMXXX-A  [EA_DOGMXXX-A]
U910  PCA8574  [PCA8574_TSSOP16]
U920  PCA9632TK  [TSSOP8]
U930  IRF7309  [SO8-2]

### Nets
+5_PCA: C910.1 C920.1 U910.16(VDD) U920.8(VDD) U930.5(D) U930.6(D)
+5V: C900.1 C901.1 C903.1 C930.1 J921.B-1 R930.2 U900.20(LED2+) U900.23(PSB) U900.24(VOUT) U900.25(VIN) U900.26(VDD) U900.32(D3) U900.33(D2) U900.34(D1) U900.35(D0) U900.40(RESET) U930.3(S) ; also sheet 1,3,4,6,12
GND: C900.2 C901.2 C903.2 C910.2 C920.2 C930.2 Q900.2(S) R901.1 U900.27(VSS) U900.38(CS) U910.1(A0) U910.2(A1) U910.3(A2) U910.8(GND) U920.5(VSS) U930.1(S) ; also sheet 1,2,4,5,6,7,8,9,11,12
LCD_BACKLIGHT: Q900.1(G) R901.2 U920.1(LED0) ; also sheet 12
N$1: R930.1 U930.4(G) U930.7(D) U930.8(D)
N$3: R923.1 U920.4(LED3)
N$4: Q900.3(D) R900.2
N$5: R922.1 U920.3(LED2)
N$6: U900.31(D4) U910.4(P0)
N$7: U900.30(D5) U910.5(P1)
N$8: U900.29(D6) U910.6(P2)
N$21: U900.28(D7) U910.7(P3)
N$22: U900.36(E) U910.9(P4)
N$23: U900.37(R/W) U910.10(P5)
N$24: U900.39(RS) U910.11(P6)
N$25: R921.1 U920.2(LED1)
N$26: U900.1(LED1+) U900.19(LED2-)
N$27: R900.1 U900.2(LED1-)
N$44: J920.B-1 R921.2
N$45: J920.B-2 R922.2
N$46: J921.B-2 R923.2
PCA_INT: U910.13(INT) ; also sheet 2
PCA_ON_OFF: U930.2(G) ; also sheet 2
SCL_5V: U910.14(SCL) U920.6(SCL) ; also sheet 3,4,6,12
SDA_5V: U910.15(SDA) U920.7(SDA) ; also sheet 3,4,6,12
Unconnected: J920.1(-1) J920.2(-2) J921.1(-1) J921.2(-2) U900.21(CAP-) U900.22(CAP+) U910.12(P7)

## Sheet 11 of 12: Lightning Sensor Adapter
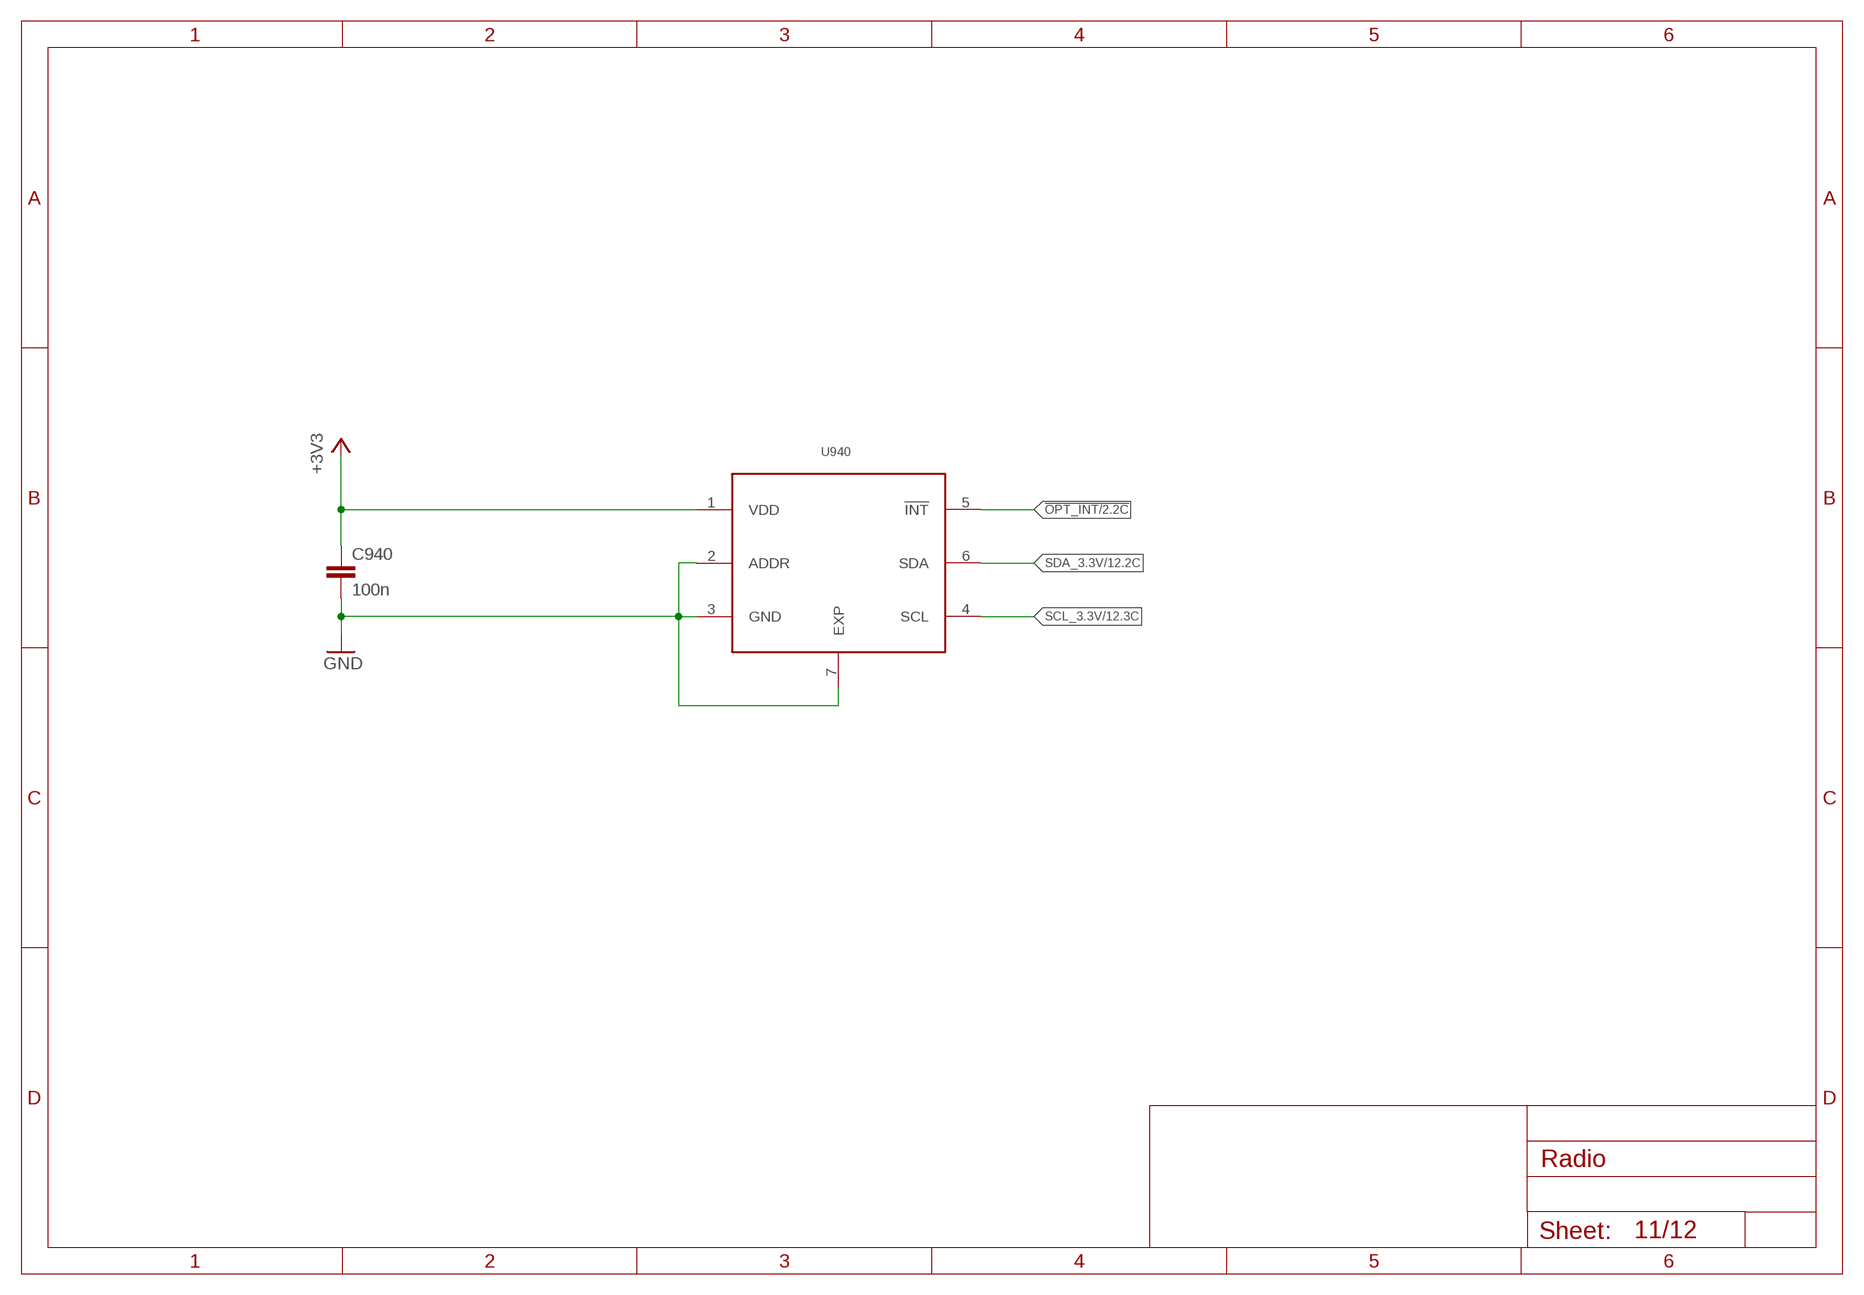
[diagram p10: schematic, sheet 11]

### Parts
C940  100n  C-EUC1206K  [C1206K]
U940  OPT3001  [SON65P200X200X65-7T66X136N]

### Nets
!OPT_INT: U940.5(!INT) ; also sheet 2
+3V3: C940.1 U940.1(VDD) ; also sheet 1,2,3,4,5,7,9,12
GND: C940.2 U940.2(ADDR) U940.3(GND) U940.7(EXP) ; also sheet 1,2,4,5,6,7,8,9,10,12
SCL_3.3V: U940.4(SCL) ; also sheet 2,3,4,7,12
SDA_3.3V: U940.6(SDA) ; also sheet 2,3,4,7,12

## Sheet 12 of 12: Testpads
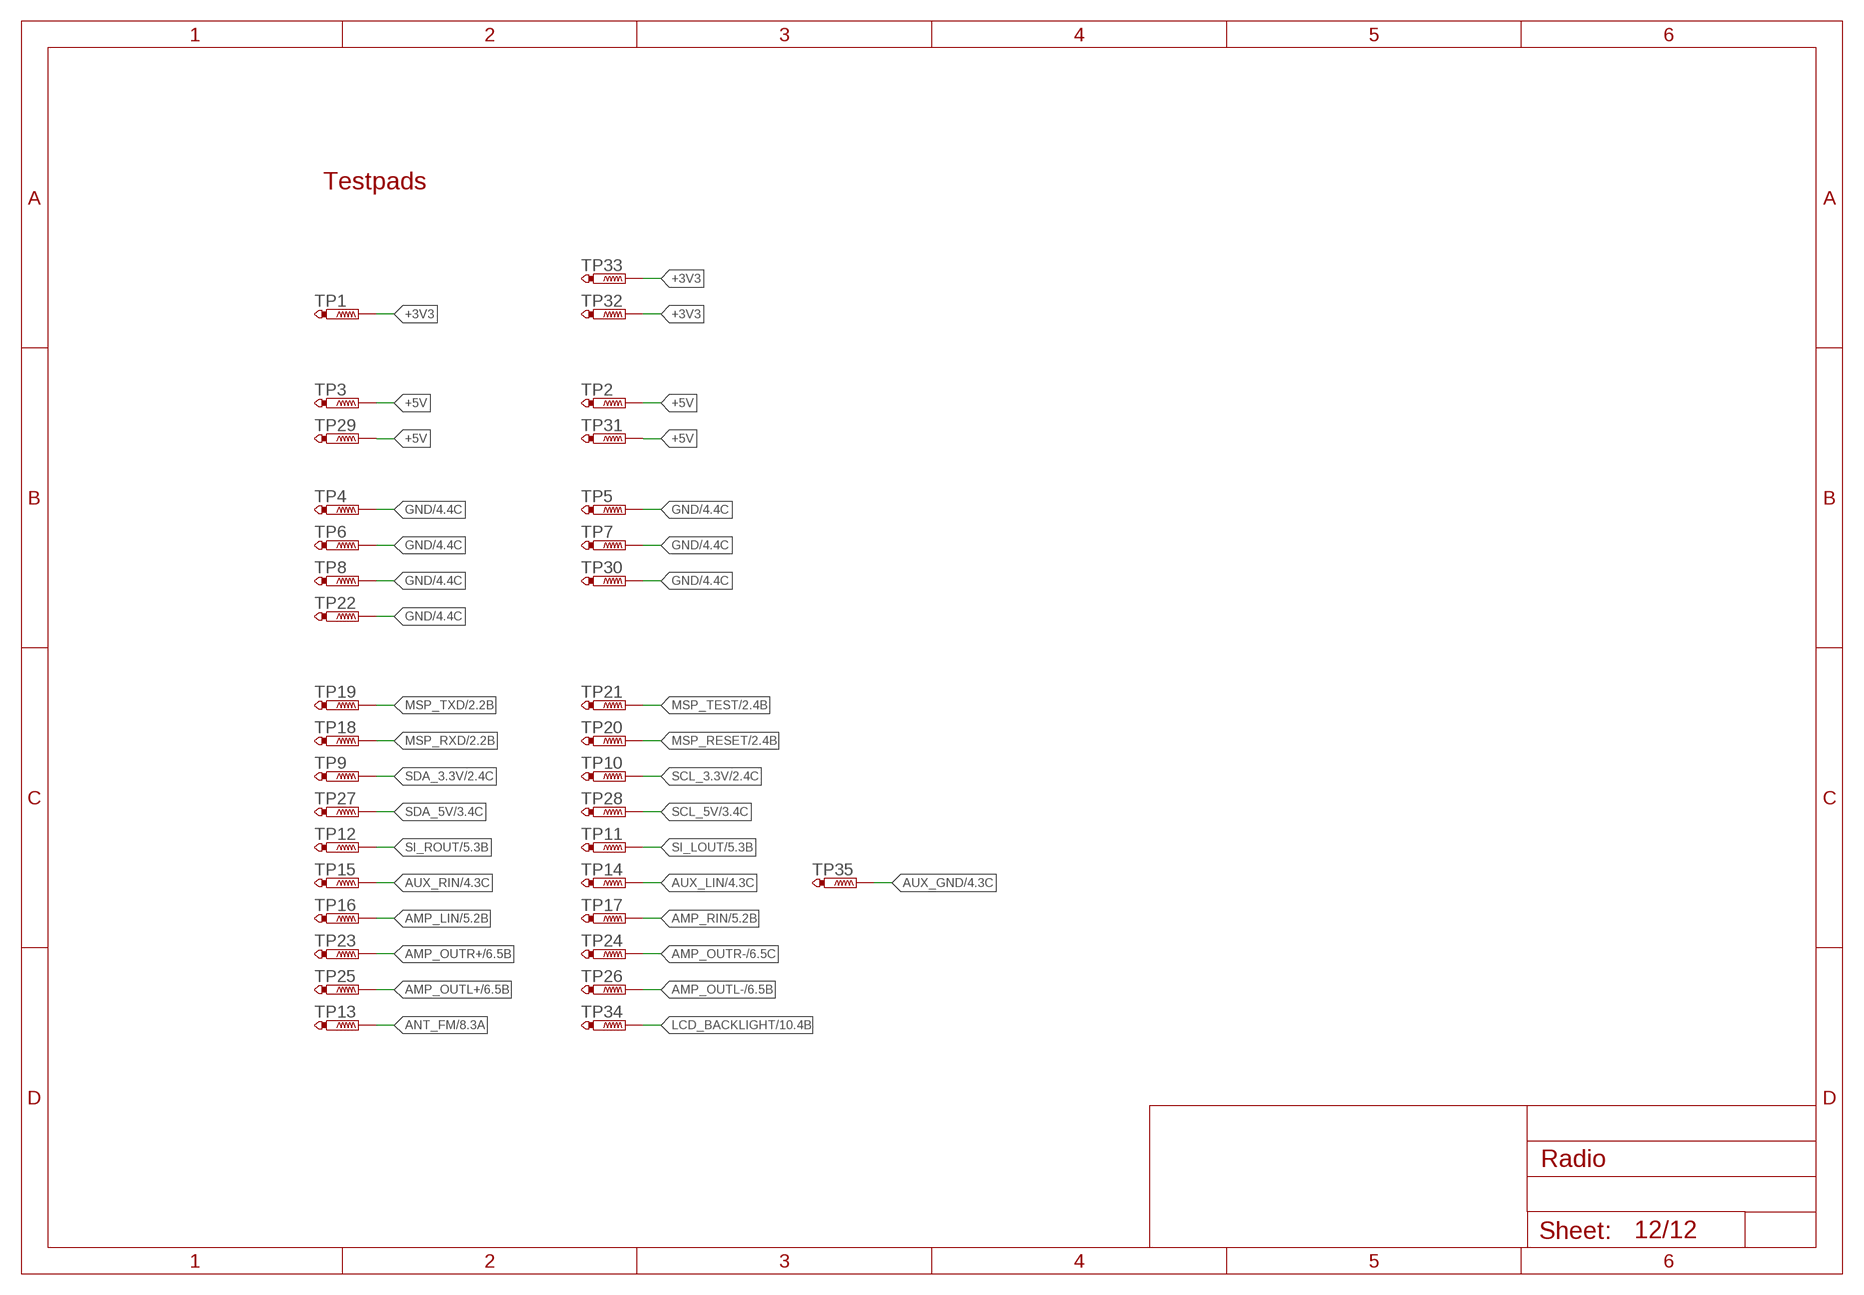
[diagram p11: schematic, sheet 12]

### Parts
TP1  PTR1B1,27  [B1,27]
TP2  PTR1B1,27  [B1,27]
TP3  PTR1B1,27  [B1,27]
TP4  PTR1B2,54  [B2,54]
TP5  PTR1B2,54  [B2,54]
TP6  PTR1B2,54  [B2,54]
TP7  PTR1B2,54  [B2,54]
TP8  PTR1B2,54  [B2,54]
TP9  PTR1B1,27  [B1,27]
TP10  PTR1B1,27  [B1,27]
TP11  PTR1B1,27  [B1,27]
TP12  PTR1B1,27  [B1,27]
TP13  PTR1B1,27  [B1,27]
TP14  PTR1B1,27  [B1,27]
TP15  PTR1B1,27  [B1,27]
TP16  PTR1B1,27  [B1,27]
TP17  PTR1B1,27  [B1,27]
TP18  PTR1B1,27  [B1,27]
TP19  PTR1B1,27  [B1,27]
TP20  PTR1B1,27  [B1,27]
TP21  PTR1B1,27  [B1,27]
TP22  PTR1B2,54  [B2,54]
TP23  PTR1B2,54  [B2,54]
TP24  PTR1B2,54  [B2,54]
TP25  PTR1B2,54  [B2,54]
TP26  PTR1B2,54  [B2,54]
TP27  PTR1B1,27  [B1,27]
TP28  PTR1B1,27  [B1,27]
TP29  PTR1B2,54  [B2,54]
TP30  PTR1B2,54  [B2,54]
TP31  PTR1B2,54  [B2,54]
TP32  PTR1B1,27  [B1,27]
TP33  PTR1B1,27  [B1,27]
TP34  PTR1B1,27  [B1,27]
TP35  PTR1B1,27  [B1,27]

### Nets
+3V3: TP1.TP TP32.TP TP33.TP ; also sheet 1,2,3,4,5,7,9,11
+5V: TP2.TP TP3.TP TP29.TP TP31.TP ; also sheet 1,3,4,6,10
AMP_LIN: TP16.TP ; also sheet 5,6
AMP_OUTL+: TP25.TP ; also sheet 6
AMP_OUTL-: TP26.TP ; also sheet 6
AMP_OUTR+: TP23.TP ; also sheet 6
AMP_OUTR-: TP24.TP ; also sheet 6
AMP_RIN: TP17.TP ; also sheet 5,6
ANT_FM: TP13.TP ; also sheet 8
AUX_GND: TP35.TP ; also sheet 4,5
AUX_LIN: TP14.TP ; also sheet 4,5
AUX_RIN: TP15.TP ; also sheet 4,5
GND: TP4.TP TP5.TP TP6.TP TP7.TP TP8.TP TP22.TP TP30.TP ; also sheet 1,2,4,5,6,7,8,9,10,11
LCD_BACKLIGHT: TP34.TP ; also sheet 10
MSP_RESET: TP20.TP ; also sheet 2,4
MSP_RXD: TP18.TP ; also sheet 2,4
MSP_TEST: TP21.TP ; also sheet 2,4
MSP_TXD: TP19.TP ; also sheet 2,4
SCL_3.3V: TP10.TP ; also sheet 2,3,4,7,11
SCL_5V: TP28.TP ; also sheet 3,4,6,10
SDA_3.3V: TP9.TP ; also sheet 2,3,4,7,11
SDA_5V: TP27.TP ; also sheet 3,4,6,10
SI_LOUT: TP11.TP ; also sheet 5,7
SI_ROUT: TP12.TP ; also sheet 5,7

### Notes on the sheet
- Testpads

## Library data of the parts
ANT HF JP400 JP401 LF MF = pinhead:PINHD-1X2: PIN HEADER
C100 C110 C200 C210 C211 C400 C500 C501 C510-C513 C600 C610 C611 C650-C655 C800-C802 C810-C812 C900 C901 C903 C910 C920 C930 C940 CP100 CP110 CP500-CP503 = rcl:C-EU: CAPACITOR, European symbol
D650 = diode:BAT54S: Schottky Diodes Pin connection corrected 2011-05-04 Source: Fairchild .. BAT54.pdf
D651 D652 = diode:DIODE-: DIODE
EN800 EN810 = Radio Projekt:PEC11R
J500 J501 J920 J921 = Radio Projekt:2060-402: SMD Terminal Strips with Push-Buttons, R/A, 2WAY; MPN: 2060-402/998-404; OC_FARNELL: 2102477; OC_NEWARK: 62T0379; PACKAGE: SMD-R/A; SUPPLIER: WAGO
JP650 = pinhead:PINHD-1X3: PIN HEADER
L510-L513 = inductors:BLM15H: EMIFIL (R) Chip Ferrite Bead for GHz Noise Source: http://www.murata.com/ Ferrite Bead BLM15H.pdf
L650-L653 = rcl:L-EU: INDUCTOR, European symbol
Q210 Q610 = Radio Projekt:QUARZ32.768KHZ
Q900 = transistor-small-signal:BSS123: N-CHANNEL MOS FET
R200 R300 R301 R310 R311 R600-R602 R650 R651 R800-R805 R810-R815 R900 R901 R921-R923 R930 = rcl:R-EU_: RESISTOR, European symbol
TP1-TP35 = testpad:PTR1: TEST PIN
U100 = Radio Projekt:LP38693: V Converter .dev
U200 = Radio Projekt:G2XX3---RHB32: MSP430G2XX1 QFN (RHB) 32 Pin Package
U300 = irf-2:IRF7103: HEXFET® Power MOSFET Adavanced Process Technology Ultra Low On-Resistance Dual N-Channel MOSFET Surface Mount Available in Tape & Reel Dynamic dv/dt Rating Fast Switching Please connect both Drain-Pins of each FET for thermal Reasons! (Pin 5 with Pin 6, 7 with 8)
U400 = Radio Projekt:TS3A44159
U500 = Radio Projekt:TPA2016D2: Amplifier .dev
U600 = Radio Projekt:SI473X-D60: AudioChip .dev; SI473X-D60: IC1
U900 = Radio Projekt:EA_DOGMXXX-A
U910 = Radio Projekt:PCA8574: I2C Expander .dev
U920 = Radio Projekt:PCA9632TK: Power LED driver
U930 = irf-2:IRF7309
U940 = Radio Projekt:OPT3001
X100 X110 = con-3m:2510-: 3M (TM) Pak 100 4-Wall Header Source: 3M; OC_FARNELL: 1788669; OC_NEWARK: unknown

## Board
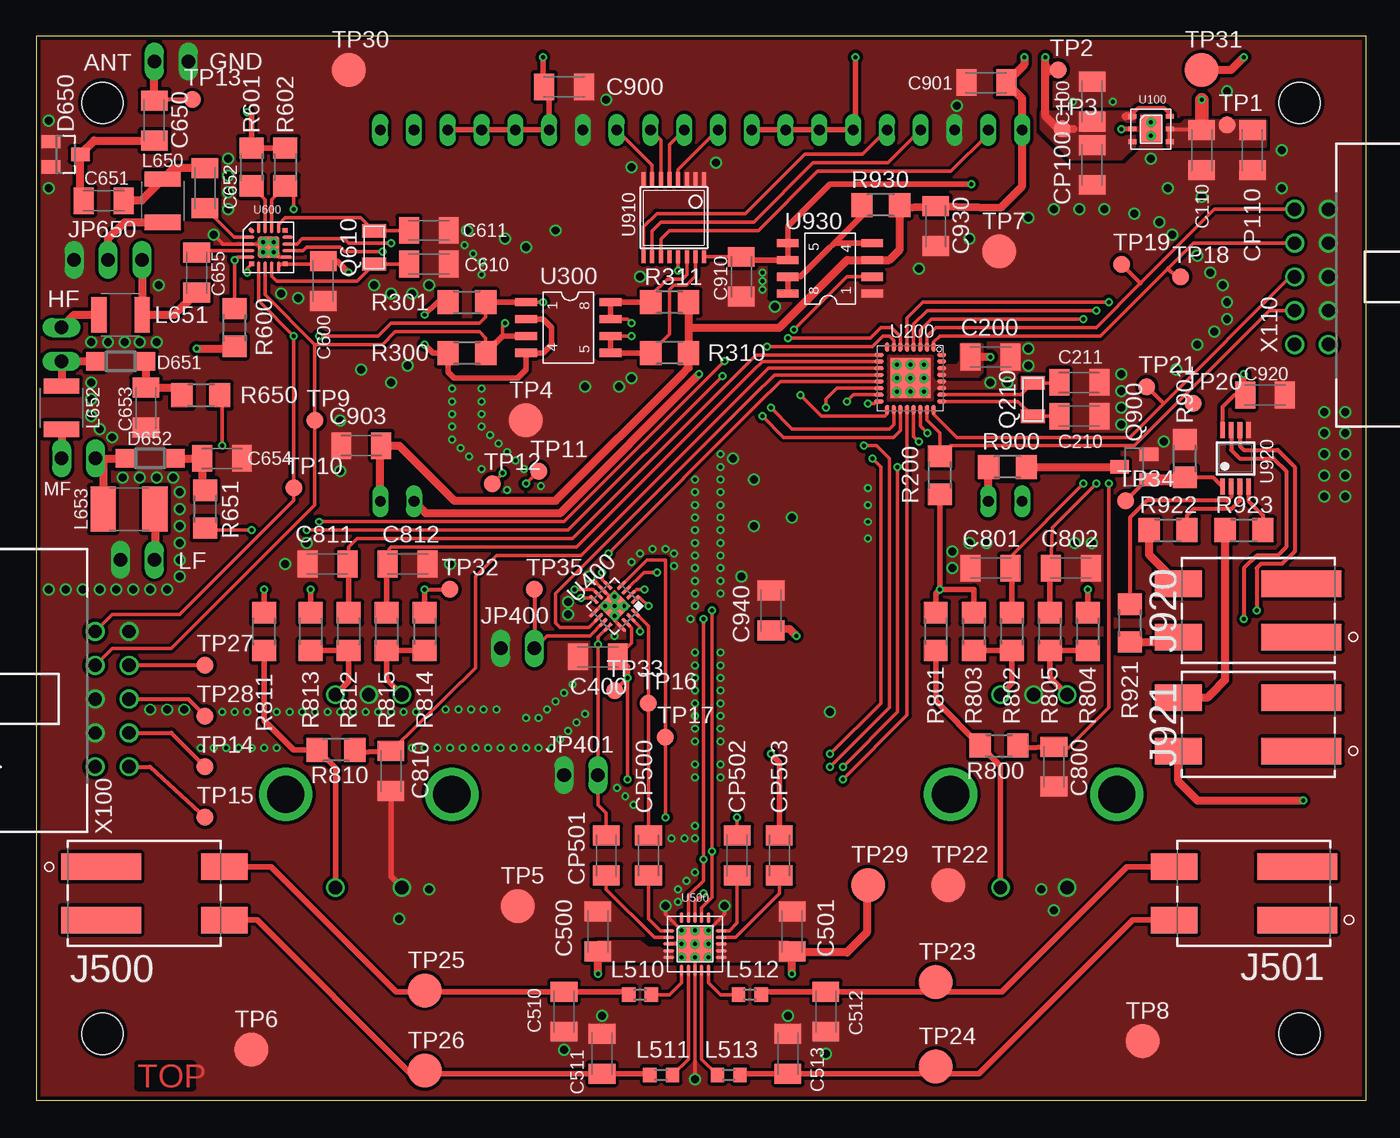
[diagram p12: board, top side]
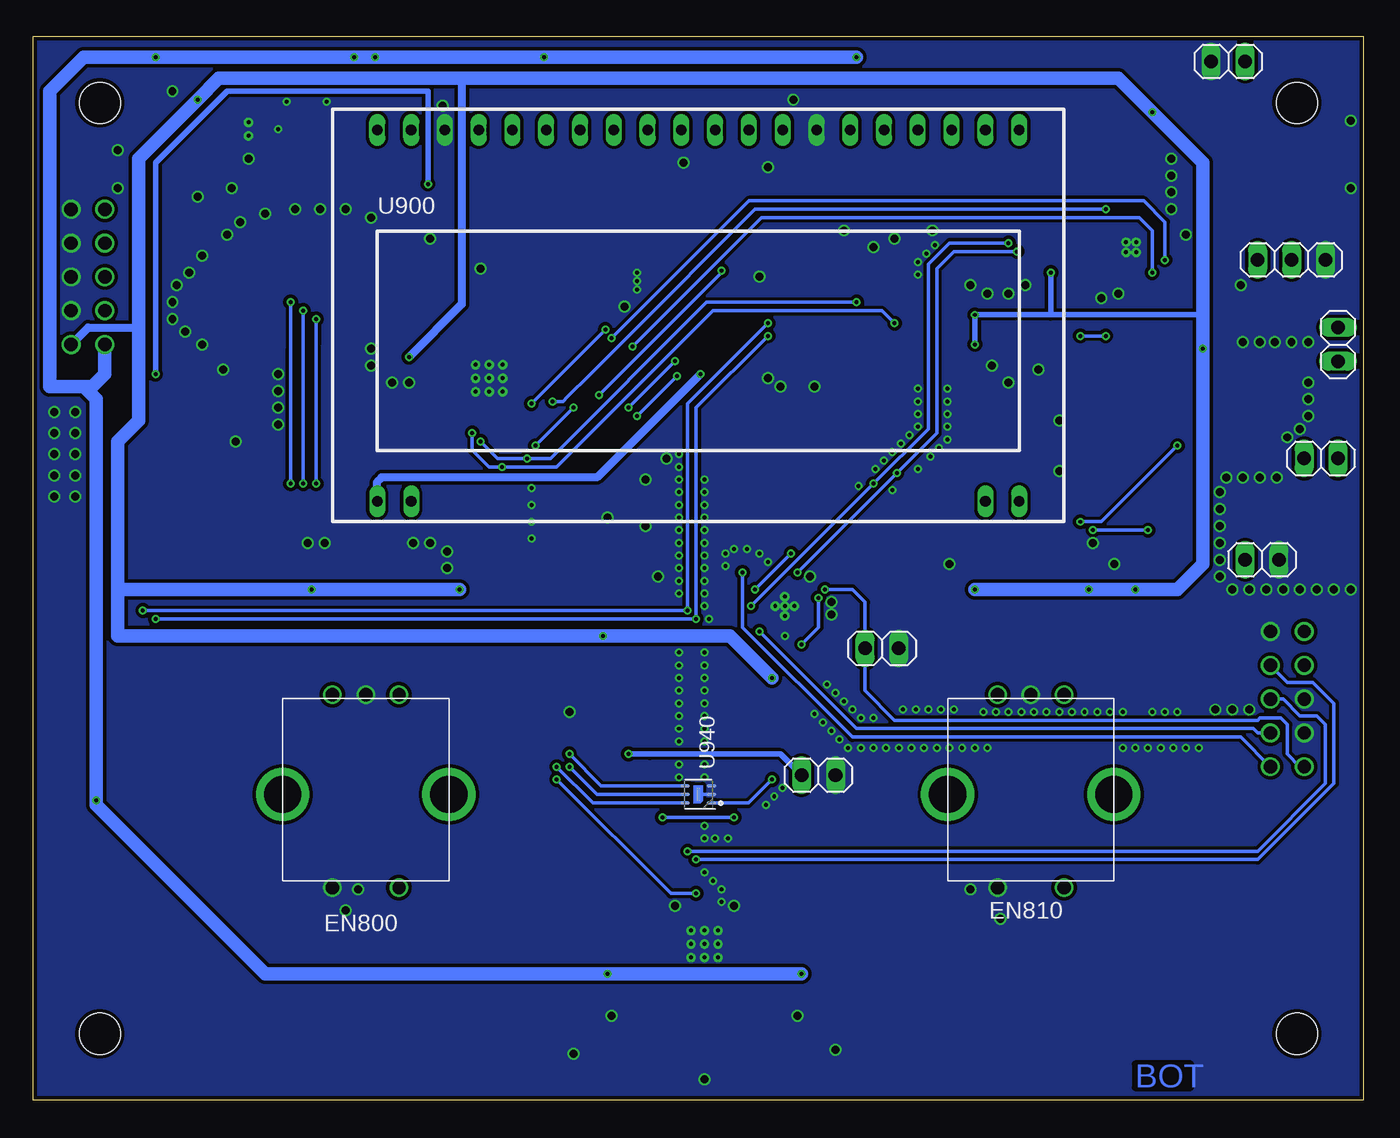
[diagram p13: board, bottom side, seen from below]

Size 100 x 80 mm. Coordinates in mm from the lower left corner, seen from the top.
Outline: 0,0 100,0 100,80 0,80 0,0
Copper layers (1*16): Top 0.035mm / dielectric 1.5mm / Bottom 0.035mm
Design rules "PCB-POOL Standard *": minimum track width 0.15mm, minimum drill 0.3mm, track to track 0.15mm, track to pad 0.15mm, pad to pad 0.15mm, via to via 0.15mm, smd to smd 0.15mm, copper to edge 0.3mm, drill to drill 0.2mm, minimum pad ring 0.2mm, minimum via ring 0.15mm, stop-mask expansion 0.075mm, vias tented up to drill 0mil, thermal gap 0.2mm
Holes 3.1 mm at 95,5 5,5 5,75 95,75
tRestrict: area 55.2,60.3 to 57.5,64.5; area 46.4,55.2 to 48.9,56.8; area 42.2,55.9 to 44.1,60.3; area 35.9,58.4 to 37.8,60.3; area 72.4,46.7 to 74,48.6; area 81,47.9 to 81.3,48.9; area 7,68.3 to 7.6,68.9; area 13.3,67.9 to 13.7,69.2; area 11.1,66.4 to 11.4,66.7

### Footprints (pad centres in the part's own frame; a part is rotated, then mirrored left to right if it is on the bottom)
1X02 = drill 1.016 long: 1 -1.27,0; 2 1.27,0
C1206K = smd 1.5 x 2: 1 -1.5,0; 2 1.5,0
SOT23 = smd 1 x 1.4: 1 -0.95,-1.1; 2 0.95,-1.1; 3 0,1.1
SOD123 = smd 1.4 x 1.4: A 1.9,0; C -1.9,0
PEC11R = drill 1: A -2.5,-7.5; B 2.5,-7.5; C 0,-7.5; S -2.5,7; W 2.5,7 | drill 2.8 pad 4: P$1 -6.25,0; P$2 6.25,0
WAGO_2060-402 = smd 6 x 2: 1 -4,2; 2 -4,-2 | smd 3.5 x 2: B-1 5.25,2; B-2 5.25,-2
1X03 = drill 1.016 long: 1 -2.54,0; 2 0,0; 3 2.54,0
R0603 = smd 1 x 1.1: 1 -0.85,0; 2 0.85,0
L1210 = smd 1.15 x 2.7: 1 -1.625,0; 2 1.625,0
L1812 = smd 1.9 x 3.4: 1 -1.95,0; 2 1.95,0
CM7V-T1A = smd 1 x 1.8: P$1 0,0; P$2 2.5,0
R1206 = smd 1.6 x 1.803: 1 -1.422,0; 2 1.422,0
B1,27 = smd 1.27 x 1.27: TP 0,0
B2,54 = smd 2.54 x 2.54: TP 0,0
LP38693_WSON = smd 0.35 x 0.6: 1 -0.95,-1.4; 2 0,-1.4; 3 0.95,-1.4; 4 0.95,1.4; 5 0,1.4; 6 -0.95,1.4 | smd 2.1 x 1.6: EXP 0,0 | drill 0.3 pad 0.35: EXP1 -0.508,0; EXP2 0.508,0
RHB32 = smd 0.7 x 0.3: 1 -2.35,1.75; 2 -2.35,1.25; 3 -2.35,0.75; 4 -2.35,0.25; 5 -2.35,-0.25; 6 -2.35,-0.75; 7 -2.35,-1.25; 8 -2.35,-1.75; 17 2.35,-1.75; 18 2.35,-1.25; 19 2.35,-0.75; 20 2.35,-0.25; 21 2.35,0.25; 22 2.35,0.75; 23 2.35,1.25; 24 2.35,1.75 | smd 0.3 x 0.7: 9 -1.75,-2.35; 10 -1.25,-2.35; 11 -0.75,-2.35; 12 -0.25,-2.35; 13 0.25,-2.35; 14 0.75,-2.35; 15 1.25,-2.35; 16 1.75,-2.35; 25 1.75,2.35; 26 1.25,2.35; 27 0.75,2.35; 28 0.25,2.35; 29 -0.25,2.35; 30 -0.75,2.35; 31 -1.25,2.35; 32 -1.75,2.35 | smd 3 x 3: TP 0,0 | drill 0.3 pad 0.35: TP1 -1.016,1.016; TP2 0,1.016; TP3 1.016,1.016; TP4 -1.016,0; TP5 0,0; TP6 1.016,0; TP7 -1.016,-1.016; TP8 0,-1.016; TP9 1.016,-1.016
SO8-2 = smd 0.61 x 1.626: 1 -2.54,-2.54; 2 -1.27,-2.54; 3 0,-2.54; 4 1.27,-2.54; 5 1.27,3.81; 6 0,3.81; 7 -1.27,3.81; 8 -2.54,3.81
QFN16 = smd 0.85 x 0.3: 1 -1.475,0.75; 2 -1.475,0.25; 3 -1.475,-0.25; 4 -1.475,-0.75; 9 1.475,-0.75; 10 1.475,-0.25; 11 1.475,0.25; 12 1.475,0.75 | smd 0.3 x 0.85: 5 -0.75,-1.475; 6 -0.25,-1.475; 7 0.25,-1.475; 8 0.75,-1.475; 13 0.75,1.475; 14 0.25,1.475; 15 -0.25,1.475; 16 -0.75,1.475 | smd 1.7 x 1.7: TH 0,0 | drill 0.3 pad 0.35: TH1 -0.508,0.508; TH2 0.508,0.508; TH3 0,0; TH4 -0.508,-0.508; TH5 0.508,-0.508
TPA2016D2_PWQFN-20 = smd 0.85 x 0.28: 1 -1.975,1; 2 -1.975,0.5; 3 -1.975,0; 4 -1.975,-0.5; 5 -1.975,-1; 11 1.975,-1; 12 1.975,-0.5; 13 1.975,0; 14 1.975,0.5; 15 1.975,1 | smd 0.28 x 0.85: 6 -1,-1.975; 7 -0.5,-1.975; 8 0,-1.975; 9 0.5,-1.975; 10 1,-1.975; 16 1,1.975; 17 0.5,1.975; 18 0,1.975; 19 -0.5,1.975; 20 -1,1.975 | smd 2.7 x 2.7: EXP 0,0 | drill 0.3 pad 0.35: EXP1 -1.016,1.016; EXP2 0,1.016; EXP3 1.016,1.016; EXP4 -1.016,0; EXP5 0,0; EXP6 1.016,0; EXP7 -1.016,-1.016; EXP8 0,-1.016; EXP9 1.016,-1.016
SI473X-D60 = smd 0.5 x 0.35 rotated 135: 1 -1.271,1.286 | smd 0.8 x 0.25: 2 -1.45,0.75; 3 -1.45,0.25; 4 -1.45,-0.25; 5 -1.45,-0.75; 12 1.35,-0.75; 13 1.45,-0.25; 14 1.45,0.25; 15 1.45,0.75 | smd 0.35 x 0.35: 6 -1.26,-1.26; 11 1.26,-1.26; 16 1.26,1.26 | smd 0.25 x 0.8: 7 -0.75,-1.45; 8 -0.25,-1.45; 9 0.25,-1.45; 10 0.75,-1.45; 17 0.75,1.45; 18 0.25,1.45; 19 -0.25,1.45; 20 -0.75,1.45 | smd 1.6 x 1.6: GND-PAD 0,0 | drill 0.3 pad 0.35: GND-PAD1 -0.381,0.381; GND-PAD2 0.381,0.381; GND-PAD3 -0.381,-0.381; GND-PAD4 0.381,-0.381
EA_DOGMXXX-A = drill 0.8 long: 1 -24.13,-13.97; 2 -21.59,-13.97; 19 21.59,-13.97; 20 24.13,-13.97; 21 24.13,13.97; 22 21.59,13.97; 23 19.05,13.97; 24 16.51,13.97; 25 13.97,13.97; 26 11.43,13.97; 27 8.89,13.97; 28 6.35,13.97; 29 3.81,13.97; 30 1.27,13.97; 31 -1.27,13.97; 32 -3.81,13.97; 33 -6.35,13.97; 34 -8.89,13.97; 35 -11.43,13.97; 36 -13.97,13.97; 37 -16.51,13.97; 38 -19.05,13.97; 39 -21.59,13.97; 40 -24.13,13.97
PCA8574_TSSOP16 = smd 0.305 x 0.991: 1 -2.275,-2.918; 2 -1.625,-2.918; 3 -0.975,-2.918; 4 -0.325,-2.918; 5 0.325,-2.918; 6 0.975,-2.918; 7 1.625,-2.918; 8 2.275,-2.918; 9 2.275,2.918; 10 1.625,2.918; 11 0.975,2.918; 12 0.325,2.918; 13 -0.325,2.918; 14 -0.975,2.918; 15 -1.625,2.918; 16 -2.275,2.918
TSSOP8 = smd 0.35 x 1.2: 1 -0.975,-2.125; 2 -0.325,-2.125; 3 0.325,-2.125; 4 0.975,-2.125; 5 0.975,2.125; 6 0.325,2.125; 7 -0.325,2.125; 8 -0.975,2.125
SON65P200X200X65-7T66X136N = smd 0.27 x 0.74: 1 -0.65,-0.995; 2 0,-0.995; 3 0.65,-0.995; 4 0.65,0.995; 5 0,0.995; 6 -0.65,0.995 | smd 0.96 x 0.26: 7 0,0
PAK100/2500-5-10 = drill 1 pad 1.422: 1 -5.08,-1.27; 2 -5.08,1.27; 3 -2.54,-1.27; 4 -2.54,1.27; 5 0,-1.27; 6 0,1.27; 7 2.54,-1.27; 8 2.54,1.27; 9 5.08,-1.27; 10 5.08,1.27

### Placement (x,y rotation side)
ANT  10.16,78.11 0 bottom
C100  79.38,75.09 90 top
C110  87.63,71.44 270 top
C200  71.75,55.88 0 top
C210  78.42,51.44 0 top
C211  78.42,53.98 0 top
C400  42.23,33.34 180 top
C500  42.23,12.7 90 top
C501  56.83,12.7 90 top
C510  39.69,6.67 90 top
C511  42.55,3.49 270 top
C512  59.37,6.67 270 top
C513  56.52,3.49 90 top
C600  21.59,61.59 270 top
C610  29.53,62.87 180 top
C611  29.53,65.41 0 top
C650  8.89,73.66 270 top
C651  5.08,67.63 180 top
C652  12.7,68.58 90 top
C653  8.26,52.07 270 top
C654  13.97,48.26 0 top
C655  12.06,62.23 270 top
C800  76.52,25.08 90 top
C801  71.75,40.01 180 top
C802  77.79,40.01 0 top
C810  26.67,24.77 270 top
C811  21.91,40.32 180 top
C812  27.94,40.32 0 top
C900  39.69,76.2 0 top
C901  71.44,76.52 180 top
C903  24.45,49.21 180 top
C910  53.02,61.91 270 top
C920  92.39,53.02 0 top
C930  67.63,65.72 270 top
C940  55.24,36.83 90 top
CP100  79.38,70.33 270 top
CP110  91.44,71.44 270 top
CP500  46.04,18.41 90 top
CP501  42.86,18.41 90 top
CP502  52.7,18.41 90 top
CP503  55.88,18.41 90 top
D650  2.22,71.12 270 top
D651  6.35,55.56 0 top
D652  8.57,48.26 0 top
EN800  75,23 180 bottom
EN810  25,23 180 bottom
HF  1.91,56.83 90 bottom
J500  8.89,15.56 0 top
J501  90.81,15.56 180 top
J920  91.12,36.83 180 top
J921  91.12,28.26 180 top
JP400  36.2,33.97 0 bottom
JP401  40.96,24.45 180 bottom
JP650  5.4,63.18 180 bottom
L510  45.4,7.94 0 top
L511  46.99,1.91 0 top
L512  53.66,7.94 180 top
L513  52.07,1.91 180 top
L650  9.53,67.63 270 top
L651  6.35,59.05 0 top
L652  1.91,52.07 90 top
L653  6.99,44.45 180 top
LF  7.62,40.64 0 bottom
MF  3.17,48.26 180 bottom
Q210  74.93,51.44 90 top
Q610  25.4,62.87 90 top
Q900  82.55,47.62 90 top
R200  67.94,46.99 270 top
R300  32.38,56.2 180 top
R301  32.38,60.01 180 top
R310  47.62,56.2 0 top
R311  47.62,60.01 0 top
R600  14.92,58.1 270 top
R601  16.19,70.17 90 top
R602  18.73,70.17 90 top
R650  12.38,53.02 180 top
R651  12.7,44.45 90 top
R800  72.39,26.67 180 top
R801  67.63,35.24 90 top
R802  73.34,35.24 90 top
R803  70.48,35.24 90 top
R804  79.06,35.24 90 top
R805  76.2,35.24 90 top
R810  22.54,26.35 0 top
R811  17.14,35.24 270 top
R812  23.5,35.24 90 top
R813  20.64,35.24 90 top
R814  29.21,35.24 90 top
R815  26.35,35.24 90 top
R900  73.03,47.62 0 top
R901  86.36,48.26 270 top
R921  82.23,35.88 270 top
R922  85.09,42.86 180 top
R923  90.81,42.86 180 top
R930  63.5,67.31 0 top
TP1  89.53,73.34 0 top
TP2  76.83,77.47 0 top
TP3  77.15,73.03 0 top
TP4  36.83,51.12 0 top
TP5  36.2,14.61 0 top
TP6  16.19,3.81 0 top
TP7  72.39,63.82 0 top
TP8  83.19,4.45 0 top
TP9  20.95,51.12 0 top
TP10  19.37,46.04 0 top
TP11  37.78,47.31 0 top
TP12  34.29,46.35 0 top
TP13  11.75,75.25 0 top
TP14  12.7,25.08 0 top
TP15  12.7,21.27 0 top
TP16  46.04,29.84 0 top
TP17  47.31,27.3 0 top
TP18  86.04,61.91 0 top
TP19  81.6,62.87 0 top
TP20  87,52.39 0 top
TP21  83.5,53.66 0 top
TP22  68.58,16.19 0 top
TP23  67.63,8.89 0 top
TP24  67.63,2.54 0 top
TP25  29.21,8.26 0 top
TP26  29.21,2.22 0 top
TP27  12.7,32.7 0 top
TP28  12.7,28.89 0 top
TP29  62.55,16.19 0 top
TP30  23.5,77.47 0 top
TP31  87.63,77.47 0 top
TP32  31.11,38.42 0 top
TP33  43.5,30.8 0 top
TP34  81.92,45.09 0 top
TP35  37.47,38.42 0 top
U100  83.82,73.03 270 top
U200  65.72,54.29 270 top
U300  39.37,57.47 270 top
U400  43.5,37.15 225 top
U500  49.53,11.75 0 top
U600  17.46,64.14 0 top
U900  50,59 0 bottom
U910  47.94,66.36 180 top
U920  90.17,48.26 0 top
U930  60.33,63.18 90 top
U940  50,23 90 bottom
X100  5.71,30.16 90 top
X110  95.89,61.91 270 top

### Tracks (layer width: path | path; a pad name or v marks a point on that pad's centre or on a via)
!OPT_INT  (via drill 0.3, 0.3 pad 0.6)
  Top 0.254: 63.33,53.5 U200.14 60.21,53.54 59.69,53.02 59.37,52.7 v59.37,52.07 | v62.23,49.21 63.18,49.21 64.14,48.26 64.14,29.53 v59.69,25.08
  Bottom 0.254: v62.23,49.21 v59.37,52.07 | v59.69,25.08 57.61,23 U940.5
!SI_EN  (via drill 0.3 pad 0.6)
  Top 0.254: U600.6 15.88,62.55 v15.88,62.23 | v54.93,56.67 61.75,56.67 62.87,56.67 63.66,57.47 64.14,57.47 64.47,57.13 U200.7
  Bottom 0.254: v15.88,62.23 15.88,65.41 16.83,66.36 45.24,66.36 v54.93,56.67
!SI_RST  (via drill 0.3 pad 0.6)
  Top 0.254: U600.5 15.12,63.38 v14.92,63.18 R600.1 | v56.52,57.31 62.71,57.31 63.5,58.1 64.29,58.1 64.97,57.42 U200.6
  Bottom 0.254: v56.52,57.31 46.2,67.63 16.51,67.63 14.92,66.04 v14.92,63.18
+3V3  (via drill 0.3, 0.3 pad 0.6)
  Top 0.254: U400.14 44.77,35.52 44.77,34.38 C400.1 | C600.1 21.37,62.88 U600.11 18.4,62.88 U600.10 | v44.45,24.13 v44.45,31.75
  Top 0.305: C110.1 87.54,73.03 U100.5 U100.4 | v29.21,38.42 TP32.TP | TP33.TP v44.45,31.75
  Top 0.406: R803.2 70.48,38.42 v67.94,38.42 | R804.2 v79.06,38.42 | R813.2 v20.64,38.42 | R814.2 v29.21,38.42 | R811.1 v17.14,38.42 | R602.2 R601.2 16.19,73.98 v15.88,74.3 | C600.1 22.63,63.09 v23.5,62.23 | R200.2 v67.94,38.42 | U300.2 38.1,58.74 38.73,58.1 38.73,56.83 38.1,56.2 U300.4 36.83,54.93 36.2,54.29 31.43,54.29 30.96,54.76 R300.2 29.84,56.2 v29.21,56.83 | R301.2 30.16,60.01 v29.21,59.05 | v44.45,31.75 44.45,32.62 C400.1 | 70.25,55.97 70.17,55.97 | R801.2 67.63,38.1 v67.94,38.42
  Top 0.61: v12.06,56.52 14.92,56.52 R600.2 | v57.15,34.92 56.65,35.43 C940.1 | v71.75,55.88 C200.1
  Top 1.016: v87.63,75.25 C110.1
  Bottom 0.254: U940.1 46.23,22.35 v44.45,24.13
  Bottom 0.406: 12.06,59.05 23.5,59.05 | 23.5,59.05 v23.5,62.23 | 23.5,59.05 v29.21,59.05 v29.21,56.83
  Bottom 0.61: 67.79,76.83 67.79,59.85 v71.75,55.88 | X110.10 95.89,58.1 92.08,58.1
  Bottom 1.016: v44.45,31.75 47.62,34.92 v57.15,34.92 93.66,34.92 93.66,38.42 | v67.94,38.42 v79.06,38.42 93.66,38.42 | v29.21,38.42 v20.64,38.42 v17.14,38.42 13.97,38.42 12.06,40.32 v12.06,56.52 12.06,59.05 12.06,70.48 v15.88,74.3 18.41,76.83 67.79,76.83 86.04,76.83 v87.63,75.25 92.08,70.8 92.08,58.1 92.08,51.12 93.66,49.53 93.66,38.42
  pour Top (isolate 0.1, no thermals): 67.94,55.24 67.94,54.45 70.8,54.45 71.12,54.77 71.12,56.83 69.53,56.83 69.53,55.56 69.22,55.24
  pour Top (isolate 0.254, no thermals): 85.09,73.34 86.04,73.34 86.36,73.66 92.39,73.66 92.39,71.75 85.09,71.75
+5_PCA  (via drill 0.3)
  Top 0.254: U910.16 52.99,63.44 C910.1
  Top 0.305: U920.8 89.19,52.13 90.08,53.02 90.81,53.02
  Top 0.406: C910.1 53.25,63.18 U930.6 U930.5 56.52,65.72 59.69,68.9 v70.33,68.9 | v90.81,54.61 90.81,53.02 C920.1
  Bottom 0.406: v70.33,68.9 70.33,75.88 85.41,75.88 90.81,70.48 v90.81,54.61
+5V  (via drill 0.3, 0.3 pad 0.6)
  Top 0.254: 78.02,73.03 78.02,72.92
  Top 0.305: 77.79,73.03 77.47,72.71 | U100.6 85.22,74.17 84.77,74.61 82.87,74.61 82.42,74.17 U100.1
  Top 0.406: U900.23 U900.24 U900.25 U900.26 38.57,75.92 C900.1 38.1,76.39 v38.1,78.42 | U900.32 U900.33 U900.34 U900.35 61.59,73.14 v61.59,78.42 | 75.88,77.47 75.88,77.79
  Top 0.61: U100.1 81.91,73.97 | 78.02,73.03 77.79,73.03 | 77.47,72.71 77.15,72.71 75.88,73.98 75.88,77.15 | U900.20 25.87,49.19 C903.1 27.3,49.21 29.53,46.99 31.43,45.09 35.56,45.09 39.05,45.09 48.58,54.61 49.05,55.08 R310.2 49.05,58.09 | v74.3,78.42 74.3,77.88 C901.1 74.13,75.33 U900.40 74.13,68.73 72.52,67.12 C930.1 65.11,67.12 R930.2 64.92,63.97 64.14,63.18 U930.3 60.96,63.18 55.87,58.09 49.05,58.09 | 75.88,77.15 75.88,77.79 v75.88,78.42 | R311.2 49.05,58.09 | J921.B-1 85.87,23.98 87.31,22.54 v95.25,22.54 | TP29.TP 62.46,16.19 62.46,12.61 60.96,11.11 56.92,11.11 C501.1 v56.83,9.53 | TP31.TP 89.85,77.47 v90.81,78.42 | TP2.TP 76.2,77.47 75.88,77.15 | v42.23,9.53 C500.1
  Bottom 1.016: v42.23,9.53 v56.83,9.53 82.55,9.53 95.25,22.23 v95.25,22.54 95.25,23.81 95.25,52.7 96.2,53.66 98.74,53.66 | v90.81,78.42 96.2,78.42 98.74,75.88 98.74,53.66 | 86.04,78.42 v90.81,78.42 | v90.81,78.42 v75.88,78.42 v74.3,78.42 v61.59,78.42 v38.1,78.42 | X110.9 94.61,54.61 95.57,53.66 98.74,53.66
  pour Top (isolate 0.254, no thermals): 42.23,11.91 45.4,11.91 46.04,11.43 47.94,11.43 47.94,10.48 42.23,10.48
  pour Top (isolate 0.254, no thermals): 56.52,11.91 51.12,11.91 51.12,10.48 56.52,10.48
  pour Top (isolate 0.254, no thermals): 75.56,73.03 77.79,70.8 81.6,70.8 82.55,71.75 82.55,74.3 75.56,74.3
AMP_GND  (via drill 0.3 pad 0.6)
  Top 0.254: U400.12 42.23,34.82 42.23,32.07 v42.23,34.29 JP401.2 42.23,22.23 42.86,21.59 CP501.2 | U400.8 41.8,37.78 v40.96,37.78
  Top 0.406: v55.24,26.04 55.88,25.4 CP503.2
  Bottom 0.254: v40.96,37.78 40.96,35.56 v42.23,34.29
  Bottom 0.406: v55.24,26.04 53.66,26.04 43.81,26.04 JP401.2
AMP_LIN
  Top 0.254: CP500.2 TP16.TP 46.04,30.48 46.04,35.67 U400.16
AMP_OUTL+
  Top 0.305: TP25.TP 28.98,8.26 28.89,8.17
  Top 0.406: J500.B-1 17.68,17.56 27.07,8.17 28.89,8.17 C510.2 44.32,8.17 L510.1
AMP_OUTL-
  Top 0.305: TP26.TP 29.21,1.99
  Top 0.406: J500.B-2 16.61,13.56 28.17,1.99 29.21,1.99 C511.2 46.05,1.99 L511.1
AMP_OUTR+
  Top 0.305: TP23.TP 67.63,8.17
  Top 0.406: J501.B-2 82.01,17.56 72.62,8.17 67.63,8.17 C512.1 54.74,8.17 L512.1
AMP_OUTR-
  Top 0.305: TP24.TP 67.63,1.99 | L513.1 53.02,1.91 53.11,1.99
  Top 0.406: J501.B-1 82.45,13.56 70.89,1.99 67.63,1.99 C513.1 53.11,1.99
AMP_RIN  (via drill 0.3)
  Top 0.254: CP502.2 v52.7,21.27 | U400.4 45.93,40.64 47.31,40.64 TP17.TP | v47.31,21.27 47.31,26.67 | 47.31,26.67 TP17.TP | TP17.TP 47.31,26.67
  Bottom 0.254: v52.7,21.27 v47.31,21.27
AMP_SHUTDOWN  (via drill 0.3 pad 0.6)
  Top 0.254: U200.20 65.47,28.96 v60.64,24.13 | U500.18 49.53,14.92 v50.16,15.56
  Bottom 0.254: v50.16,15.56 52.07,15.56 v60.64,24.13
ANT_FM
  Top 0.305: TP13.TP 8.98,75.25 C650.1
  Top 0.61: C650.1 ANT.2
ANT_LF  (via drill 0.3 pad 0.6)
  Top 0.254: U200.19 64.97,50.37 64.45,49.85 56.2,49.85 v54.61,51.44 | v51.59,54.45 40.01,42.86 30.8,42.86 v20.32,42.86 | v16.19,42.86 12.87,42.86 R651.1
  Bottom 0.254: v54.61,51.44 v51.59,54.45 | v20.32,42.86 v16.19,42.86
ANT_MF  (via drill 0.3 pad 0.6)
  Top 0.254: U200.18 64.47,50.82 64.14,50.48 56.83,50.48 v55.24,52.07 | v51.75,55.56 39.69,43.5 v21.27,43.5 | v13.97,49.21 13.97,52.86
  Top 0.305: R650.1 13.97,52.86
  Bottom 0.254: v55.24,52.07 v51.75,55.56 | v21.27,43.5 19.68,43.5 v13.97,49.21
AUDIO_SW_GND
  Top 0.254: U400.10 41.56,35.56 39.37,35.56 39.05,35.88 39.05,38.1 40.96,40.01 53.86,52.91 55.49,54.54 U200.12
AUDIO_SW_LINE  (via drill 0.3 pad 0.6)
  Top 0.254: U400.2 45.12,38.42 v45.72,38.42 | v43.02,41.12 54.31,52.41 55.95,54.04 U200.13
  Bottom 0.254: v45.72,38.42 v43.02,41.12
AUX_GND  (via drill 0.3 pad 0.6)
  Top 0.254: U400.11 41.63,34.92 38.42,34.92 JP400.1 | v40.48,38.42 41.87,38.42 U400.7
  Top 0.305: TP35.TP JP400.1
  Bottom 0.254: X100.2 4.76,25.08 5.71,26.04 5.71,28.26 6.19,28.73 7.78,28.73 7.94,28.57 35.24,28.57 37.47,30.8 JP400.1 37.47,37.47 38.42,38.42 v40.48,38.42
AUX_LIN  (via drill 0.3 pad 0.6)
  Top 0.254: v45.4,35.24 45.4,35.6 U400.15
  Top 0.305: X100.3 10.16,27.62 TP14.TP
  Bottom 0.254: v45.4,35.24 38.1,27.94 8.26,27.94 7.94,27.62 X100.3
AUX_RIN  (via drill 0.3 pad 0.6)
  Top 0.254: v46.67,39.69 45.68,39.69 U400.3
  Top 0.305: X100.1 8.57,25.08 TP15.TP
  Bottom 0.254: X100.1 9.21,27.3 38.42,27.3 46.67,35.56 v46.67,39.69
EN1_A  (via drill 0.3, 0.3 pad 0.6)
  Top 0.254: U200.3 66.47,57.9 67.31,58.74 v78.74,58.74 | C801.1 73.16,40.77 v78.74,46.35
  Top 0.406: R802.2 73.34,39.82 C801.1
  Bottom 0.254: v78.74,46.35 78.74,56.83 v78.74,58.74
EN1_B  (via drill 0.3, 0.3 pad 0.6)
  Top 0.254: C802.1 76.39,43.05 v79.69,46.35 | U200.4 65.97,58.35 66.99,59.37 v79.69,59.37
  Top 0.406: R805.2 76.2,39.82 C802.1
  Bottom 0.254: v79.69,46.35 79.69,57.47 v79.69,59.37
EN1_TAST  (via drill 0.3, 0.3 pad 0.6)
  Top 0.254: C800.2 77.6,26.48 80.64,29.53 80.64,41.27 v80.64,46.35 | U200.5 65.47,58.8 66.67,60.01 v80.64,60.01
  Top 0.406: R800.1 74,26.48 C800.2
  Bottom 0.254: v80.64,46.35 80.64,55.88 | 80.64,55.88 80.64,56.52 | v80.64,60.01 80.64,56.52 | 80.64,56.52 80.64,55.88
EN2_A
  Top 0.254: 23.5,40.13 23.5,41.59 24.13,42.23 26.04,42.23 40.32,42.23 53.98,55.88 54.14,56.04 U200.9
  Top 0.406: R812.2 23.5,40.13 C811.1
EN2_B
  Top 0.254: C812.1 26.54,41.46 26.67,41.59 40.64,41.59 53.98,54.93 54.59,55.54 U200.10
  Top 0.406: R815.2 26.35,40.13 C812.1
EN2_TAST
  Top 0.254: U200.11 55.04,55.04 54.93,54.93 42.55,42.55 40.96,40.96 34.61,40.96 33.02,39.37 33.02,35.88 33.02,32.52 C810.1
  Top 0.406: R810.2 24.15,26.16 C810.1
GND  (via drill 0.3, 0.6, 0.6 pad 0.6, 0.6 pad 0.9)
  Top 0.254: v49.53,1.59 U500.8 U500.EXP5 | v41.59,39.37 41.63,39.37 U400.6 43.5,37.5 U400.TH3 42.44,37.15 U400.9 | 17.14,64.45 17.08,64.39 U600.3 13.97,64.39 13.97,64.45 v13.34,65.09 | U600.12 18.21,63.38 17.78,63.82 | v47.31,14.61 47.31,13.97 48.58,12.7 50.48,12.7 51.75,13.97 v51.75,14.61 | U400.13 43.5,36.09 43.5,36.51
  Top 0.305: U100.2 v81.6,73.03 | U500.EXP5 U500.3
  Top 0.406: EN810.W 26.67,16.83 C810.2
  Bottom 0.254: U940.7 U940.2
  other vias: 52.39,48.26 53.98,46.67 56.83,43.81 53.02,39.37 59.69,29.21 43.5,34.92 26.67,53.98 24.45,54.93 45.4,61.91 55.56,59.69 39.69,3.81 42.55,6.35 56.52,6.35 59.37,3.49 27.3,13.65 29.53,15.88 31.11,40.32 20.32,41.91 18.73,40.32 27.94,55.24 25.4,61.28 4.76,50.48 4.13,51.44 0.95,68.58 71.75,53.98 81.6,54.61 81.6,53.34 81.6,52.07 51.12,70.48 44.77,70.17 39.05,65.41 35.24,64.77 36.83,64.14 70.17,64.77 74.61,66.36 83.82,70.8 87.63,67.94 78.42,66.99 85.09,68.58 76.52,14.29 75.56,15.88 68.9,40.01 78.11,41.91 84.77,49.53 96.84,51.75 80.33,66.99 42.86,75.25 69.22,74.77 40.01,37.47 53.98,43.18 4.13,53.98 9.21,61.28 10.79,43.18 4.13,52.7 0.95,38.42 10.79,41.91 9.84,38.42 3.49,38.42 4.76,38.42 6.03,38.42 2.22,38.42 14.45,69.53 10.79,39.37 0.95,73.66 7.3,38.42 8.57,38.42 10.79,40.64 41.27,53.66 43.81,53.66 44.77,54.29 22.86,47.31 22.86,51.12 73.03,53.98 74.61,56.52 85.41,65.09 87.31,63.5 66.36,62.55 10.79,44.45 10.79,45.72 10.32,46.83 9.05,46.83 7.78,46.83 6.51,46.83 5.71,49.85 4.13,56.99 5.4,56.99 6.67,56.99 7.78,56.99 9.05,56.99 14.45,70.8 14.45,66.99 14.45,68.26 18.41,60.64 19.68,60.33 26.67,60.64 28.26,60.64 29.53,61.28 32.38,65.41 40.01,36.51 8.57,29.37 9.84,29.37 11.11,29.37 54.61,62.23 54.61,61.59 54.61,60.96 68.9,41.27 70.17,41.91 71.44,41.91 79.38,41.91 74.61,55.24 81.6,50.8 49.53,46.67 49.53,45.72 49.53,44.77 49.53,43.81 49.53,42.86 49.53,41.91 49.53,40.96 49.53,40.01 49.53,39.05 49.53,38.1 49.53,37.15 49.21,36.2 49.53,33.66 49.53,32.7 49.53,31.75 49.53,30.8 49.53,29.84 49.53,28.89 49.53,27.94 49.53,26.99 49.53,25.24 49.53,24.29 49.53,20.64 49.53,19.68 49.53,17.14 48.9,16.51 48.26,15.88 48.26,14.92 51.44,48.58 51.44,47.62 51.44,46.67 51.44,45.72 51.44,44.77 51.44,43.81 31.27,53.5 32.23,64.29 32.86,63.66 33.5,63.02 33.5,62.07 31.27,52.55 31.27,51.59 31.27,50.64 31.27,49.69 31.91,49.05 32.54,48.42 33.5,47.47 33.5,53.5 33.5,52.55 33.5,51.59 33.5,50.64 34.13,50.01 34.77,49.37 35.4,48.74 36.04,48.1 36.67,47.47 35.4,45.88 37.94,46.2 44.77,40.48 45.4,41.12 46.35,41.43 47.31,41.43 47.94,41.12 47.94,40.16 13.97,29.21 14.92,29.21 15.88,29.21 18.1,29.21 19.05,29.21 20,29.21 20.95,29.21 21.91,29.21 22.86,29.21 23.81,29.21 24.77,29.21 25.72,29.21 26.67,29.21 27.62,29.21 28.57,29.21 12.38,26.51 13.34,26.51 14.29,26.51 15.24,26.51 16.19,26.51 17.14,26.51 18.1,26.51 28.26,26.51 29.21,26.51 30.16,26.51 31.11,26.51 32.07,26.51 33.02,26.51 33.97,26.51 34.92,26.51 35.88,26.51 36.83,26.51 37.78,26.51 38.73,26.51 39.37,27.15 40.01,27.78 40.64,28.42 41.27,29.05 40.32,31.27 39.69,30.64 39.05,30 38.42,29.37 37.78,28.73 36.83,28.73 30.8,29.37 31.75,29.37 32.7,29.37 33.66,29.37 34.61,29.37 48.74,19.68 47.78,19.68 43.66,23.5 44.29,22.86 44.93,22.23 51.44,42.86 51.44,41.91 51.44,40.96 51.44,40.01 51.44,39.05 51.44,38.1 51.44,33.66 51.44,32.7 51.44,31.75 51.44,30.8 51.44,29.84 51.44,28.89 51.44,27.94 51.44,26.99 51.44,25.24 51.44,24.29 98.42,51.75 96.84,50.16 98.42,50.16 96.84,48.58 98.42,48.58 96.84,46.99 98.42,46.99 96.84,45.4 98.42,45.4 93.66,68.58 93.66,71.44 89.53,75.88 62.55,46.04 62.55,44.77 62.55,43.5 62.55,42.23 88.27,62.23 89.22,61.28 84.45,66.04 89.53,58.74 82.55,66.67 89.53,60.01 76.52,66.99 87.31,56.83 85.72,54.93 88.58,57.78 80.96,75.09 77.95,75.09
  pour Top (isolate 0.254, rank 2, no thermals): 0,80.01 100.01,80.01 100.01,0 0,0
  pour Bottom (isolate 0.254, no thermals): 0,80.01 100.01,80.01 100.01,0 0,0
LCD_BACKLIGHT
  Top 0.305: U920.1 88.49,46.84 R901.2 | Q900.1 83.5,46.67 TP34.TP
  Top 0.813: Q900.1 86.36,46.67 R901.2
MSP_RESET
  Top 0.254: U200.23 66.97,51.14 67.94,50.16 R200.1 68.75,49.21 82.55,49.21 86.36,53.02 92.71,59.37 X110.7
  Top 0.305: TP20.TP 86.36,53.02
MSP_RXD
  Top 0.254: U200.1 67.47,56.99 67.94,57.47 80.01,57.47 85.09,62.55 87,64.45 X110.3
  Top 0.305: TP18.TP 85.72,61.91 85.09,62.55
MSP_TEST
  Top 0.254: U200.24 67.47,51.59 69.22,49.85 82.23,49.85 84.77,52.39 94.3,61.91 X110.5
  Top 0.305: TP21.TP 84.77,52.39
MSP_TXD
  Top 0.254: U200.2 66.97,57.45 67.63,58.1 79.69,58.1 83.03,61.44 88.58,66.99 X110.1
  Top 0.305: TP19.TP 83.03,61.44
MSP_XIN
  Top 0.254: U200.26 74.04,53.04 Q210.P$2 76.88,53.94 C211.1
MSP_XOUT
  Top 0.254: U200.25 73.82,52.54 Q210.P$1 C210.1
N$1
  Top 0.406: U930.8 U930.7 57.47,61.91 58.42,62.87 59.69,64.14 | 59.69,64.14 59.85,64.3 | U930.4 60.01,64.45 59.85,64.3 | 59.85,64.3 59.69,64.14 | 59.85,64.3 62.08,66.52 R930.1
N$2
  Top 0.61: 3.32,67.63 C651.2 3.32,67.63 | 3.32,67.63 D650.3 4.36,72.16 C650.2
N$3
  Top 0.305: U920.4 91.14,45.06 91.44,44.77 92.23,43.98 R923.1
N$4
  Top 0.61: R900.2 Q900.3
N$5
  Top 0.305: U920.3 90.5,45.09 89.85,44.45 87,44.45 86.68,44.13 86.51,43.97 R922.1
N$6
  Top 0.254: U910.4 48.27,69.97 U900.31
N$7
  Top 0.254: U910.5 47.62,71.86 U900.30
N$8
  Top 0.254: U910.6 46.97,72.19 U900.29
N$9
  Top 0.254: U500.6 48.53,8.84 47.62,7.94 L510.2
N$10
  Top 0.254: U500.7 49.03,3.1 L511.2
N$11
  Top 0.254: U500.10 50.53,8.84 51.44,7.94 L512.2
N$12
  Top 0.254: U500.9 50.03,3.1 L513.2
N$17
  Top 0.254: U500.1 46.94,12.75 46.35,13.34 46.04,13.65 CP500.1
N$18
  Top 0.254: U500.15 52.12,12.75 52.7,13.34 CP502.1
N$19
  Top 0.254: U500.2 46.49,12.25 42.86,15.88 CP501.1
N$20
  Top 0.254: U500.14 52.57,12.25 55.88,15.56 CP503.1
N$21
  Top 0.254: U910.7 46.32,70.3 U900.28
N$22
  Top 0.254: U910.9 45.67,65.67 46.67,66.67 53.34,66.67 57.78,71.12 62.12,71.12 U900.36
N$23
  Top 0.254: U910.10 46.32,65.37 46.99,66.04 53.98,66.04 58.42,70.48 64.03,70.48 U900.37
N$24
  Top 0.254: U910.11 46.97,64.75 47.62,65.41 54.29,65.41 58.74,69.85 68.79,69.85 71.59,72.65 U900.39
N$25
  Top 0.305: U920.2 89.84,45.4 89.53,45.09 83.5,45.09 82.23,43.81 R921.1
N$26  (via drill 0.3 pad 0.6)
  Top 0.61: v49.85,54.61 39.37,44.13 35.56,44.13 29.31,44.13 U900.19
  Bottom 0.61: v49.85,54.61 57.63,46.83 58.42,46.83 73.82,46.83 74.13,46.52 U900.1
N$27
  Top 0.61: U900.2 71.6,45.04 R900.1
N$28
  Top 0.61: HF.2 2.86,59.05 L651.1
N$29
  Top 0.61: L650.2 6.63,66 5.4,64.77 JP650.2
N$30
  Top 0.61: JP650.3 7.97,63.15 L651.2 10.39,59.05 C655.2
N$31
  Top 0.61: D651.C HF.1 L652.2
N$32
  Top 0.406: EN810.A 23.5,31.5 R812.1 R813.1
N$33
  Top 0.406: EN800.A 73.34,31.34 R802.1 R803.1
N$34
  Top 0.61: L653.2 5.04,48.26 MF.2 D652.C
N$35
  Top 0.406: EN810.B 26.35,31.65 R815.1 R814.1
N$36
  Top 0.406: R801.1 67.63,30.01 R800.2 72.5,25.14 EN800.S
N$37
  Top 0.406: R811.2 17.14,28.57 19.37,26.35 R810.1 22.5,24.97 EN810.S
N$38
  Top 0.61: D652.A C654.1 12.47,46.1 R651.2
N$39
  Top 0.61: D651.A C653.1 10.41,53.57 R650.2
N$40
  Top 0.61: L653.1 8.94,40.69 LF.1
N$42
  Top 0.61: L652.1 MF.1
N$43
  Top 0.61: C651.1 6.58,67.67 7.95,67.67 L650.1 10.35,70.08 C652.2
N$44
  Top 0.61: R921.2 85.87,34.46 J920.B-1
N$45
  Top 0.61: R922.2 83.67,41.03 J920.B-2
N$46
  Top 0.61: R923.2 89.38,31.6 88.27,30.48 88.04,30.26 J921.B-2
PCA_INT  (via drill 0.3 pad 0.6)
  Top 0.254: v48.26,62.39 v48.27,62.4 U910.13 | v57.47,53.02 58.42,52.07 59.05,51.44 63.82,51.44 63.97,51.59 U200.17
  Bottom 0.254: v48.26,62.39 48.26,62.23 57.15,53.34 v57.47,53.02
PCA_ON_OFF  (via drill 0.3 pad 0.6)
  Top 0.254: U930.2 60.96,61.91 v56.99,57.94 | v62.55,52.39 63.02,52.39 63.18,52.54 U200.16
  Bottom 0.254: v56.99,57.94 v62.55,52.39
R904
  Top 0.406: EN800.B 76.2,31.8 R805.1 R804.1
SCL_3.3V  (via drill 0.3, 0.3 pad 0.6)
  Top 0.254: U600.7 16.71,60.12 v19.37,57.47 TP10.TP | v21.27,57.47 25.72,57.47 26.67,58.42 33.34,58.42 33.81,58.89 R301.1 | U200.21 65.97,49.91 v66.36,49.53 | v38.1,60.01 36.51,60.01 U300.1 | X100.10 5.71,36.51 10.79,36.51 19.37,45.09 19.37,45.72 | v62.87,48.26 63.5,47.62 63.5,29.84 v59.69,26.04
  Top 0.305: TP10.TP 19.37,45.72
  Top 0.406: R301.1 U300.1
  Bottom 0.254: v19.37,57.47 v21.27,57.47 | v66.36,49.53 65.09,48.26 v62.87,48.26 61.12,48.26 49.37,60.01 v38.1,60.01 | v59.69,26.04 57.3,23.65 U940.4
SCL_5V  (via drill 0.3 pad 0.6)
  Top 0.254: U300.7 44.45,58.74 v44.77,58.42 | U500.17 50.03,14.47 50.48,14.92 50.8,15.24 v50.8,18.73 v50.8,36.83 | U910.14 48.92,62.09 48.58,61.75 47.47,61.75 46.2,60.49 46.2,60.17 R311.1
  Top 0.305: U920.6 90.5,49.2 90.81,48.9 93.34,48.9 94.61,47.62 94.61,41.27 93.66,40.32 92.08,40.32 91.76,40.01 v91.76,36.83 | X100.5 11.43,30.16 TP28.TP
  Top 0.406: R311.1 U300.8 U300.7
  Bottom 0.254: v44.77,58.42 50.8,52.39 v50.8,36.83 v91.76,36.83 | X100.5 6.03,30.16 4.76,28.89 3.49,28.89 2.86,28.26 2.86,23.81 7.94,18.73 v50.8,18.73
SDA_3.3V  (via drill 0.3, 0.3 pad 0.6)
  Top 0.254: U600.8 17.21,60.58 20.95,56.83 | R300.1 33.81,57.32 33.34,57.78 29.53,57.78 26.99,57.78 26.04,56.83 20.95,56.83 | U200.22 66.47,50.69 v66.99,50.16 | v35.24,58.42 35.08,58.26 35.08,57.47 | X100.8 5.71,33.97 10.16,33.97 20.95,44.77 20.95,50.8 | TP9.TP 20.95,56.83 | v64.77,47.62 64.77,29.21 v60.64,25.08
  Top 0.305: TP9.TP 20.95,50.8
  Top 0.406: U300.3 35.08,57.47 R300.1
  Bottom 0.254: v66.99,50.16 66.99,48.9 65.72,47.62 v64.77,47.62 60.64,47.62 48.9,59.37 36.2,59.37 v35.24,58.42 | v60.64,25.08 57.91,22.35 U940.6
SDA_5V  (via drill 0.3 pad 0.6)
  Top 0.254: U910.15 49.57,61.95 48.9,61.28 47.94,61.28 47.62,60.96 47.62,57.62 R310.1 | U500.19 49.03,14.63 49.03,15.38 49.21,15.56 50.16,16.51 v50.16,18.1 v50.16,36.2 | U300.6 v44.77,57.47
  Top 0.305: U920.7 89.84,48.9 90.49,48.26 93.03,48.26 93.98,47.31 93.98,41.59 93.34,40.96 91.76,40.96 90.81,40.01 v90.81,36.2 | TP27.TP X100.7
  Top 0.406: U300.6 U300.5 R310.1
  Bottom 0.254: v44.77,57.47 50.16,52.07 v50.16,36.2 v90.81,36.2 | X100.7 5.71,31.43 3.81,31.43 2.22,29.84 2.22,23.81 7.94,18.1 v50.16,18.1
SI_AMI
  Top 0.254: U600.4 12.22,63.88 C655.1
SI_FMI
  Top 0.254: U600.2 14.89,64.89 C652.1
SI_GPO1
  Top 0.254: U600.19 17.21,67.72 R601.1
SI_GPO3
  Top 0.254: U600.17 18.21,65.84 18.73,66.36 24.41,66.36 Q610.P$2 25.4,65.41 C611.1
SI_INT  (via drill 0.3 pad 0.6)
  Top 0.254: U600.18 17.71,67.72 R602.1 19.37,68.11 v19.37,66.99 | U200.15 61.46,53.04 v60.96,52.55
  Bottom 0.254: v19.37,66.99 45.72,66.99 55.56,57.15 58.74,53.98 59.21,53.5 59.85,52.86 60.17,52.55 v60.96,52.55
SI_LOUT  (via drill 0.3, 0.3 pad 0.6)
  Top 0.254: U600.14 19.62,64.39 20,64.77 23.18,64.77 23.5,64.45 v26.67,64.45 | U400.1 45.19,37.78 45.4,37.78 v46.04,37.15 | v36.83,46.35 TP11.TP
  Bottom 0.254: v26.67,64.45 31.11,64.45 32.7,62.87 32.7,53.98 32.7,50.48 v36.83,46.35 v46.04,37.15
SI_RCLK
  Top 0.254: C610.2 Q610.P$1 24.13,61.59 18.1,61.59 17.71,61.98 U600.9
SI_ROUT  (via drill 0.3, 0.3 pad 0.6)
  Top 0.254: U600.13 20.07,63.88 20.32,64.14 22.86,64.14 23.18,63.82 v26.04,63.82 | v42.55,39.69 42.55,39.16 U400.5 | v35.08,47.15 34.92,46.99 TP12.TP
  Bottom 0.254: v26.04,63.82 30.8,63.82 32.07,62.55 32.07,50.16 v35.08,47.15 36.51,45.72 v42.55,39.69

### Text on the board
Top: TOP
Bottom: BOT
tNames: GND